# Altium project DSPBOARD.PRJPCB
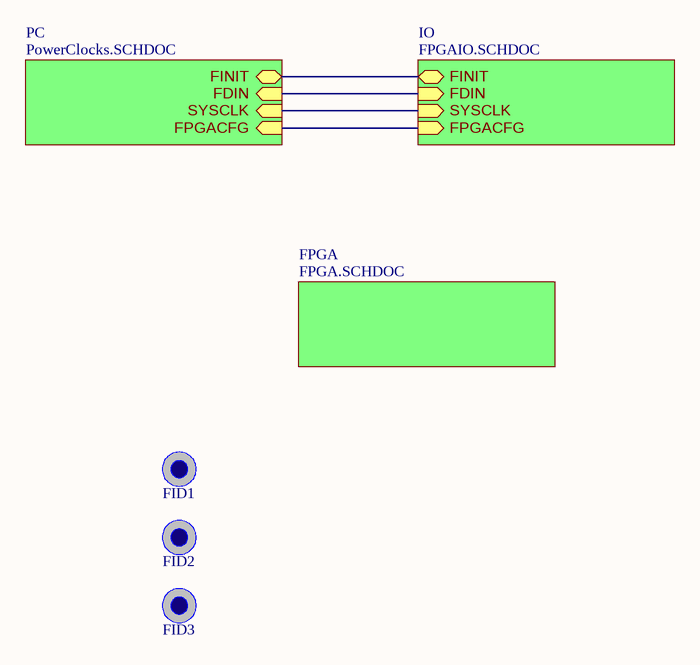
[diagram p0: main.SCHDOC]
6 sheets, 201 parts. Net scope: hierarchical (ports join the sheet entries above them; power ports are global).
Board file: pcb.PCBDOC
Sheets:
  main.SCHDOC
    PC = PowerClocks.SCHDOC
    IO = FPGAIO.SCHDOC
      FIBER = fiber.SCHDOC
    FPGA = FPGA.SCHDOC
      A = DSP.SCHDOC
      B = DSP.SCHDOC
      C = DSP.SCHDOC
      D = DSP.SCHDOC

## Sheet main.SCHDOC
size B

### Parts
FID1  *  [FIDUCIAL]  (value not drawn)
FID2  *  [FIDUCIAL]  (value not drawn)
FID3  *  [FIDUCIAL]  (value not drawn)

### Sub-sheets
FPGA = FPGA.SCHDOC: no entries
IO = FPGAIO.SCHDOC: FPGACFG (in), SYSCLK (in), FINIT (bidir), FDIN (in)
PC = PowerClocks.SCHDOC: FINIT (bidir), FDIN (in), SYSCLK (in), FPGACFG (in)

### Nets
NetIO1_P13: sheet PC/FPGACFG, sheet IO/FPGACFG
NetO1_3: sheet PC/SYSCLK, sheet IO/SYSCLK
NetU3_M11: sheet PC/FDIN, sheet IO/FDIN
NetU3_N9: sheet PC/FINIT, sheet IO/FINIT

### Notes on the sheet
- Title:
- Engineer:
- Date:
- Revision:
- Sheet
- of
- File:

### Library data of the parts
FID1-FID3 = FIDUCIAL

## Sheet PowerClocks.SCHDOC
size B
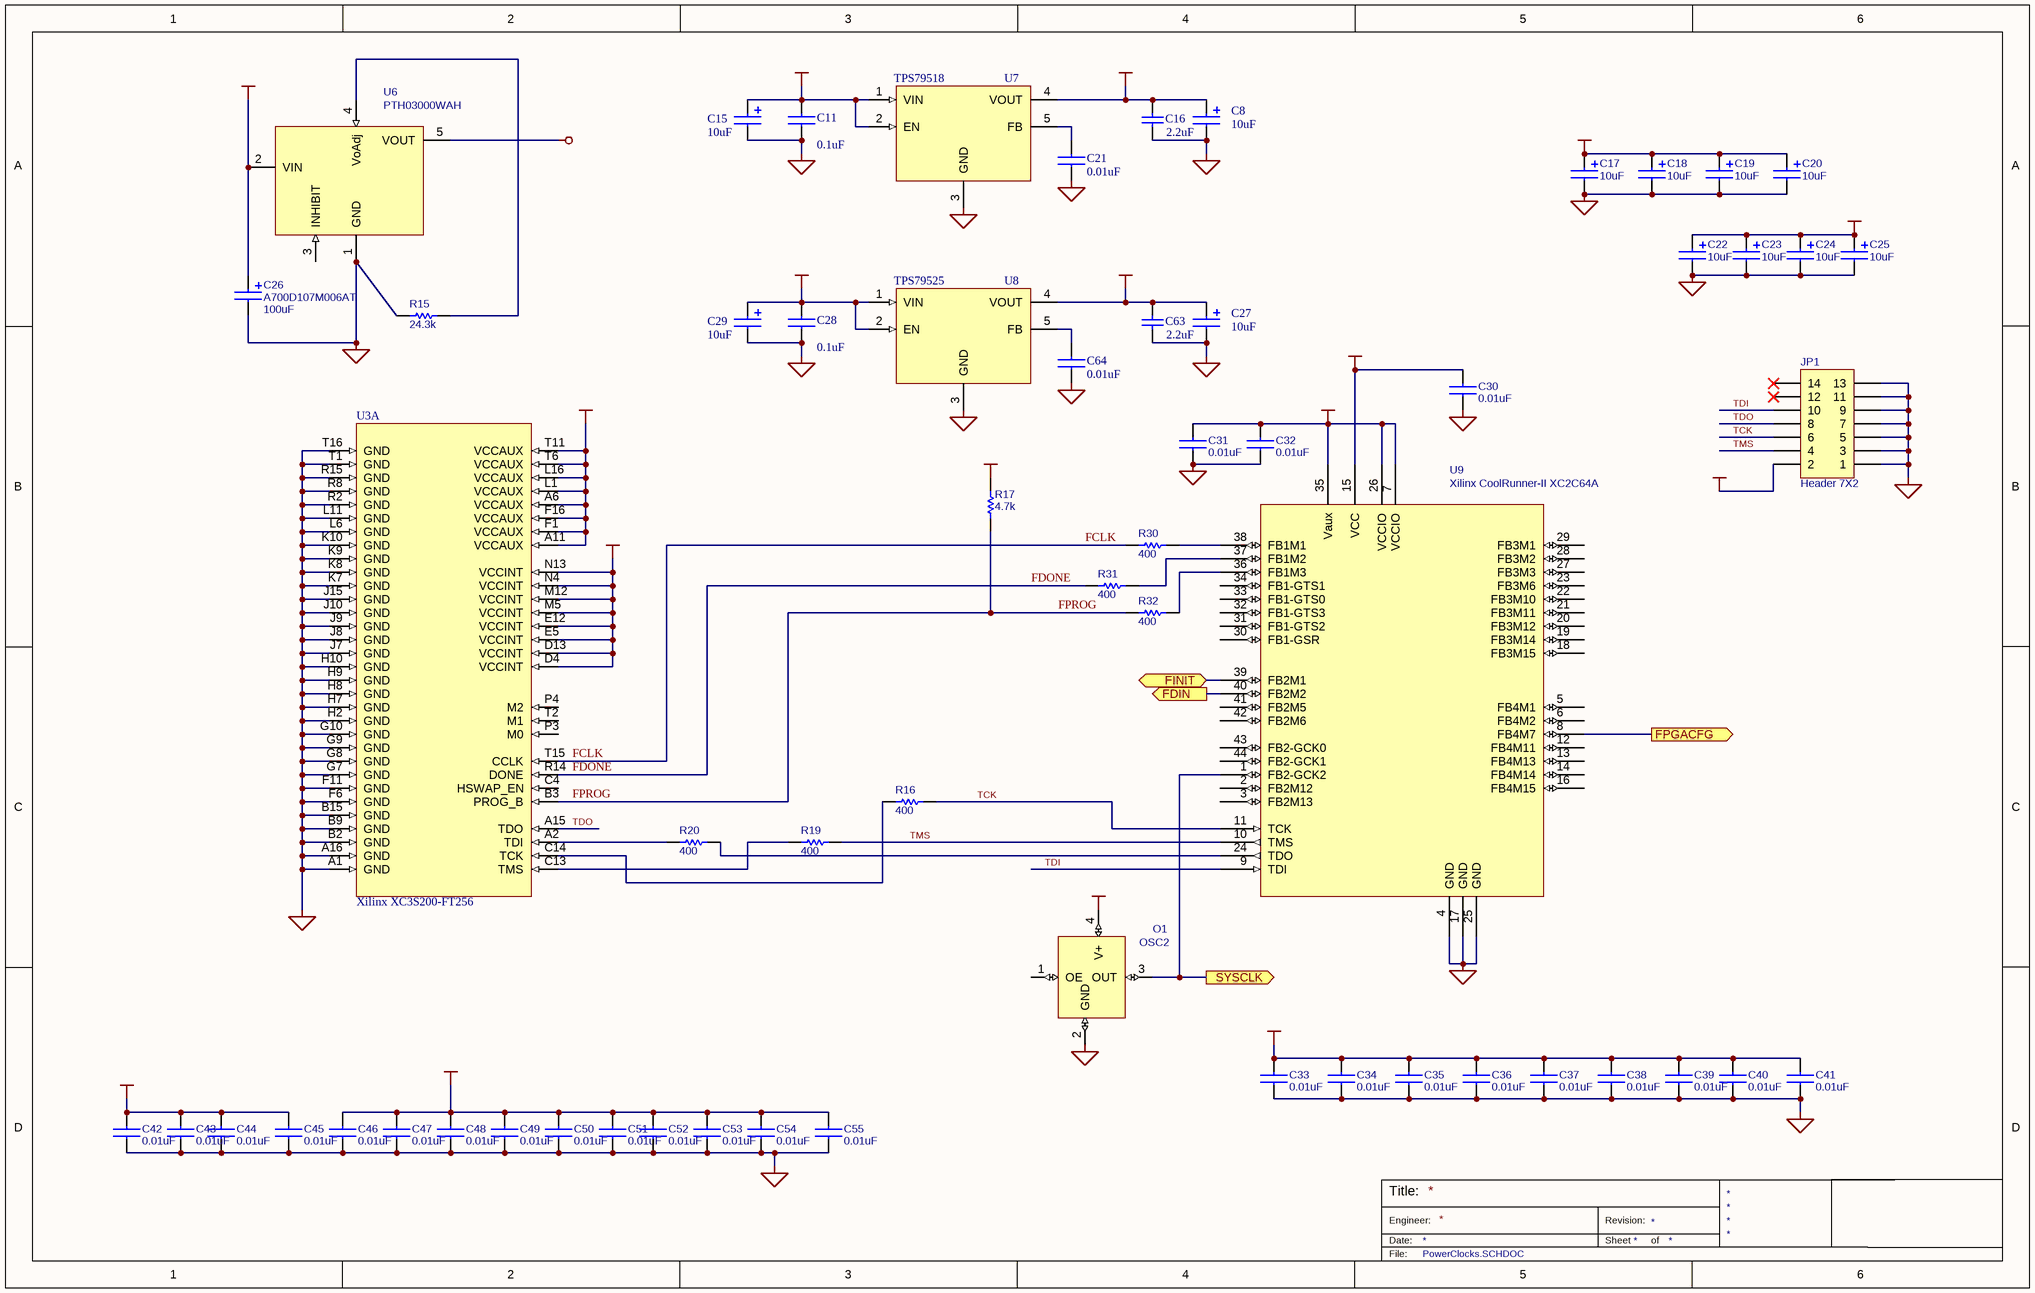
[diagram p1: PowerClocks.SCHDOC]

### Parts
C8  value 10uF  [3216]  (hidden comment: POLCAP)
C11  value 0.1uF  [0603]  (hidden comment: CAPACITOR)
C15  value 10uF  [3216]  (hidden comment: POLCAP)
C16  value 2.2uF  [1206]  (hidden comment: Cap)
C17  value 10uF  [3216]  (hidden comment: Bypass Cap)
C18  value 10uF  [3216]  (hidden comment: Bypass Cap)
C19  value 10uF  [3216]  (hidden comment: Bypass Cap)
C20  value 10uF  [3216]  (hidden comment: Bypass Cap)
C21  value 0.01uF  [0402]  (hidden comment: CAPACITOR)
C22  value 10uF  [3216]  (hidden comment: Bypass Cap)
C23  value 10uF  [3216]  (hidden comment: Bypass Cap)
C24  value 10uF  [3216]  (hidden comment: Bypass Cap)
C25  value 10uF  [3216]  (hidden comment: Bypass Cap)
C26  A700D107M006AT  value 100uF  [7343]
C27  value 10uF  [3216]  (hidden comment: POLCAP)
C28  value 0.1uF  [0603]  (hidden comment: CAPACITOR)
C29  value 10uF  [3216]  (hidden comment: POLCAP)
C30  value 0.01uF  [0402]  (hidden comment: CAPACITOR)
C31  value 0.01uF  [0402]  (hidden comment: CAPACITOR)
C32  value 0.01uF  [0402]  (hidden comment: CAPACITOR)
C33  value 0.01uF  [0402]  (hidden comment: CAPACITOR)
C34  value 0.01uF  [0402]  (hidden comment: CAPACITOR)
C35  value 0.01uF  [0402]  (hidden comment: CAPACITOR)
C36  value 0.01uF  [0402]  (hidden comment: CAPACITOR)
C37  value 0.01uF  [0402]  (hidden comment: CAPACITOR)
C38  value 0.01uF  [0402]  (hidden comment: CAPACITOR)
C39  value 0.01uF  [0402]  (hidden comment: CAPACITOR)
C40  value 0.01uF  [0402]  (hidden comment: CAPACITOR)
C41  value 0.01uF  [0402]  (hidden comment: CAPACITOR)
C42  value 0.01uF  [0402]  (hidden comment: CAPACITOR)
C43  value 0.01uF  [0402]  (hidden comment: CAPACITOR)
C44  value 0.01uF  [0402]  (hidden comment: CAPACITOR)
C45  value 0.01uF  [0402]  (hidden comment: CAPACITOR)
C46  value 0.01uF  [0402]  (hidden comment: CAPACITOR)
C47  value 0.01uF  [0402]  (hidden comment: CAPACITOR)
C48  value 0.01uF  [0402]  (hidden comment: CAPACITOR)
C49  value 0.01uF  [0402]  (hidden comment: CAPACITOR)
C50  value 0.01uF  [0402]  (hidden comment: CAPACITOR)
C51  value 0.01uF  [0402]  (hidden comment: CAPACITOR)
C52  value 0.01uF  [0402]  (hidden comment: CAPACITOR)
C53  value 0.01uF  [0402]  (hidden comment: CAPACITOR)
C54  value 0.01uF  [0402]  (hidden comment: CAPACITOR)
C55  value 0.01uF  [0402]  (hidden comment: CAPACITOR)
C63  value 2.2uF  [1206]  (hidden comment: Cap)
C64  value 0.01uF  [0402]  (hidden comment: CAPACITOR)
JP1  Header 7X2  [SMT 2x7 2mm HDR]
O1  OSC2  [ECS-3953M]
R15  value 24.3k  [1206]  (hidden comment: RESISTOR)
R16  value 400  [0603]  (hidden comment: current-limiting series res)
R17  value 4.7k  [0603]  (hidden comment: RESISTOR)
R19  value 400  [0603]  (hidden comment: current-limiting series res)
R20  value 400  [0603]  (hidden comment: current-limiting series res)
R30  value 400  [0603]  (hidden comment: current-limiting series res)
R31  value 400  [0603]  (hidden comment: current-limiting series res)
R32  value 400  [0603]  (hidden comment: current-limiting series res)
U3  Xilinx XC3S200-FT256  [Xilinx FT256 BGA]  (part A of 9)
U6  PTH03000WAH  [TI EUS]
U7  TPS79518  [SOT223-5/Simple]
U8  TPS79525  [SOT223-5/Simple]
U9  Xilinx CoolRunner-II XC2C64A  [QFP10x10-G44/G10N]

### Ports
FDIN (out), FINIT (bidir), FPGACFG (out), SYSCLK (out)

### Nets
+1.2VCC: C22.1 C23.1 C24.1 C25.1 C42.2 C43.2 C44.2 C45.2 U3.D4(VCCINT) U3.D13(VCCINT) U3.E5(VCCINT) U3.E12(VCCINT) U3.M5(VCCINT) U3.M12(VCCINT) U3.N4(VCCINT) U3.N13(VCCINT) U6.5(VOUT)
+1.8VCC: C8.1 C16.2 C30.2 U7.4(VOUT) U9.15(VCC)
+2.5VCC: C27.1 C46.2 C47.2 C48.2 C49.2 C50.2 C51.2 C52.2 C53.2 C54.2 C55.2 C63.2 R17.1 U3.A6(VCCAUX) U3.A11(VCCAUX) U3.F1(VCCAUX) U3.F16(VCCAUX) U3.L1(VCCAUX) U3.L16(VCCAUX) U3.T6(VCCAUX) U3.T11(VCCAUX) U8.4(VOUT)
GND: C8.2 C11.1 C15.2 C16.1 C17.2 C18.2 C19.2 C20.2 C21.1 C22.2 C23.2 C24.2 C25.2 C26.2 C27.2 C28.1 C29.2 C30.1 C31.1 C32.1 C33.1 C34.1 C35.1 C36.1 C37.1 C38.1 C39.1 C40.1 C41.1 C42.1 C43.1 C44.1 C45.1 C46.1 C47.1 C48.1 C49.1 C50.1 C51.1 C52.1 C53.1 C54.1 C55.1 C63.1 C64.1 JP1.1 JP1.3 JP1.5 JP1.7 JP1.9 JP1.11 JP1.13 O1.2(GND) R15.2 U3.A1(GND) U3.A16(GND) U3.B2(GND) U3.B9(GND) U3.B15(GND) U3.F6(GND) U3.F11(GND) U3.G7(GND) U3.G8(GND) U3.G9(GND) U3.G10(GND) U3.H2(GND) U3.H7(GND) U3.H8(GND) U3.H9(GND) U3.H10(GND) U3.J7(GND) U3.J8(GND) U3.J9(GND) U3.J10(GND) U3.J15(GND) U3.K7(GND) U3.K8(GND) U3.K9(GND) U3.K10(GND) U3.L6(GND) U3.L11(GND) U3.R2(GND) U3.R8(GND) U3.R15(GND) U3.T1(GND) U3.T16(GND) U6.1(GND) U7.3(GND) U8.3(GND) U9.4(GND) U9.17(GND) U9.25(GND)
VCC: C11.2 C15.1 C17.1 C18.1 C19.1 C20.1 C26.1 C28.2 C29.1 C31.2 C32.2 C33.2 C34.2 C35.2 C36.2 C37.2 C38.2 C39.2 C40.2 C41.2 JP1.2 O1.4(V+) U6.2(VIN) U7.1(VIN) U7.2(EN) U8.1(VIN) U8.2(EN) U9.7(VCCIO) U9.26(VCCIO) U9.35(Vaux)
FCLK: R30.2 U3.T15(CCLK)
FDONE: R31.2 U3.R14(DONE)
FPROG: R17.2 R32.2 U3.B3(PROG_B)
TCK: JP1.6 R16.1 U9.11(TCK)
TDI: JP1.10 U9.9(TDI)
TDO: JP1.8 U3.A15(TDO)
TMS: JP1.4 R19.2 U9.10(TMS)
NetC21_2: C21.2 U7.5(FB)
NetC64_2: C64.2 U8.5(FB)
NetIO1_P13: U9.8(FB4M7) ; port FPGACFG
NetO1_3: O1.3(OUT) U9.1(FB2-GCK2) ; port SYSCLK
NetR15_1: R15.1 U6.4(VoAdj)
NetR16_2: R16.2 U3.C14(TCK)
NetR19_1: R19.1 U3.C13(TMS)
NetR20_1: R20.1 U9.24(TDO)
NetR20_2: R20.2 U3.A2(TDI)
NetR30_1: R30.1 U9.38(FB1M1)
NetR31_1: R31.1 U9.37(FB1M2)
NetR32_1: R32.1 U9.36(FB1M3)
NetU3_M11: U9.40(FB2M2) ; port FDIN
NetU3_N9: U9.39(FB2M1) ; port FINIT

Not connected (* = marked no-connect by the designer): JP1 12* 14*; O1 1(OE); U3 C4(HSWAP_EN) P3(M0) P4(M2) T2(M1); U6 3(INHIBIT); U9 2(FB2M12) 3(FB2M13) 5(FB4M1) 6(FB4M2) 12(FB4M11) 13(FB4M13) 14(FB4M14) 16(FB4M15) 18(FB3M15) 19(FB3M14) 20(FB3M12) 21(FB3M11) 22(FB3M10) 23(FB3M6) 27(FB3M3) 28(FB3M2) 29(FB3M1) 30(FB1-GSR) 31(FB1-GTS2) 32(FB1-GTS3) 33(FB1-GTS0) 34(FB1-GTS1) 41(FB2M5) 42(FB2M6) 43(FB2-GCK0) 44(FB2-GCK1)

### Notes on the sheet
- Title:
- Engineer:
- Date:
- Revision:
- Sheet
- of
- File:

### Library data of the parts
C8 C15 C17-C20 C22-C25 C27 C29 = POLCAP: Standard Capacitor; Voltage: 10V
C11 C21 C28 C30-C55 C64 = CAPACITOR: Standard Capacitor
C16 C63 = Cap: Capacitor; Manufacturer: Generic Components; Class I: Passive; Published: 8-Jun-2000; Revision: July-2002: Re-released for DXP Platform.; Publisher: Altium Limited; Class II: Capacitor
C26 = POLCAP: Standard Capacitor
JP1 = Header 7X2: Header, 7-Pin, Dual row; Manufacturer: Generic Components; Class I: Connector; Vendor: MOLEX 87831-1420; Revision: July-2002: Re-released for DXP Platform.; Publisher: Altium Limited
O1 = OSC2: ECS SMD Oscillator, ECS-3953M
R15 R16 R19 R20 R30-R32 = RESISTOR: Standard Passive Resistor
R17 = RESISTOR: Standard Passive Resistor; Tolerance: 1%
U3 = XC3S200-FT256: Xilinx Spartan-3 FPGA
U6 = PTH03000: TI POL converter, through-hole
U7 U8 = TPS795XX: TI Ultra-low-noise LDO
U9 = XC2C64A-5VQ44C

## Sheet FPGAIO.SCHDOC
size B
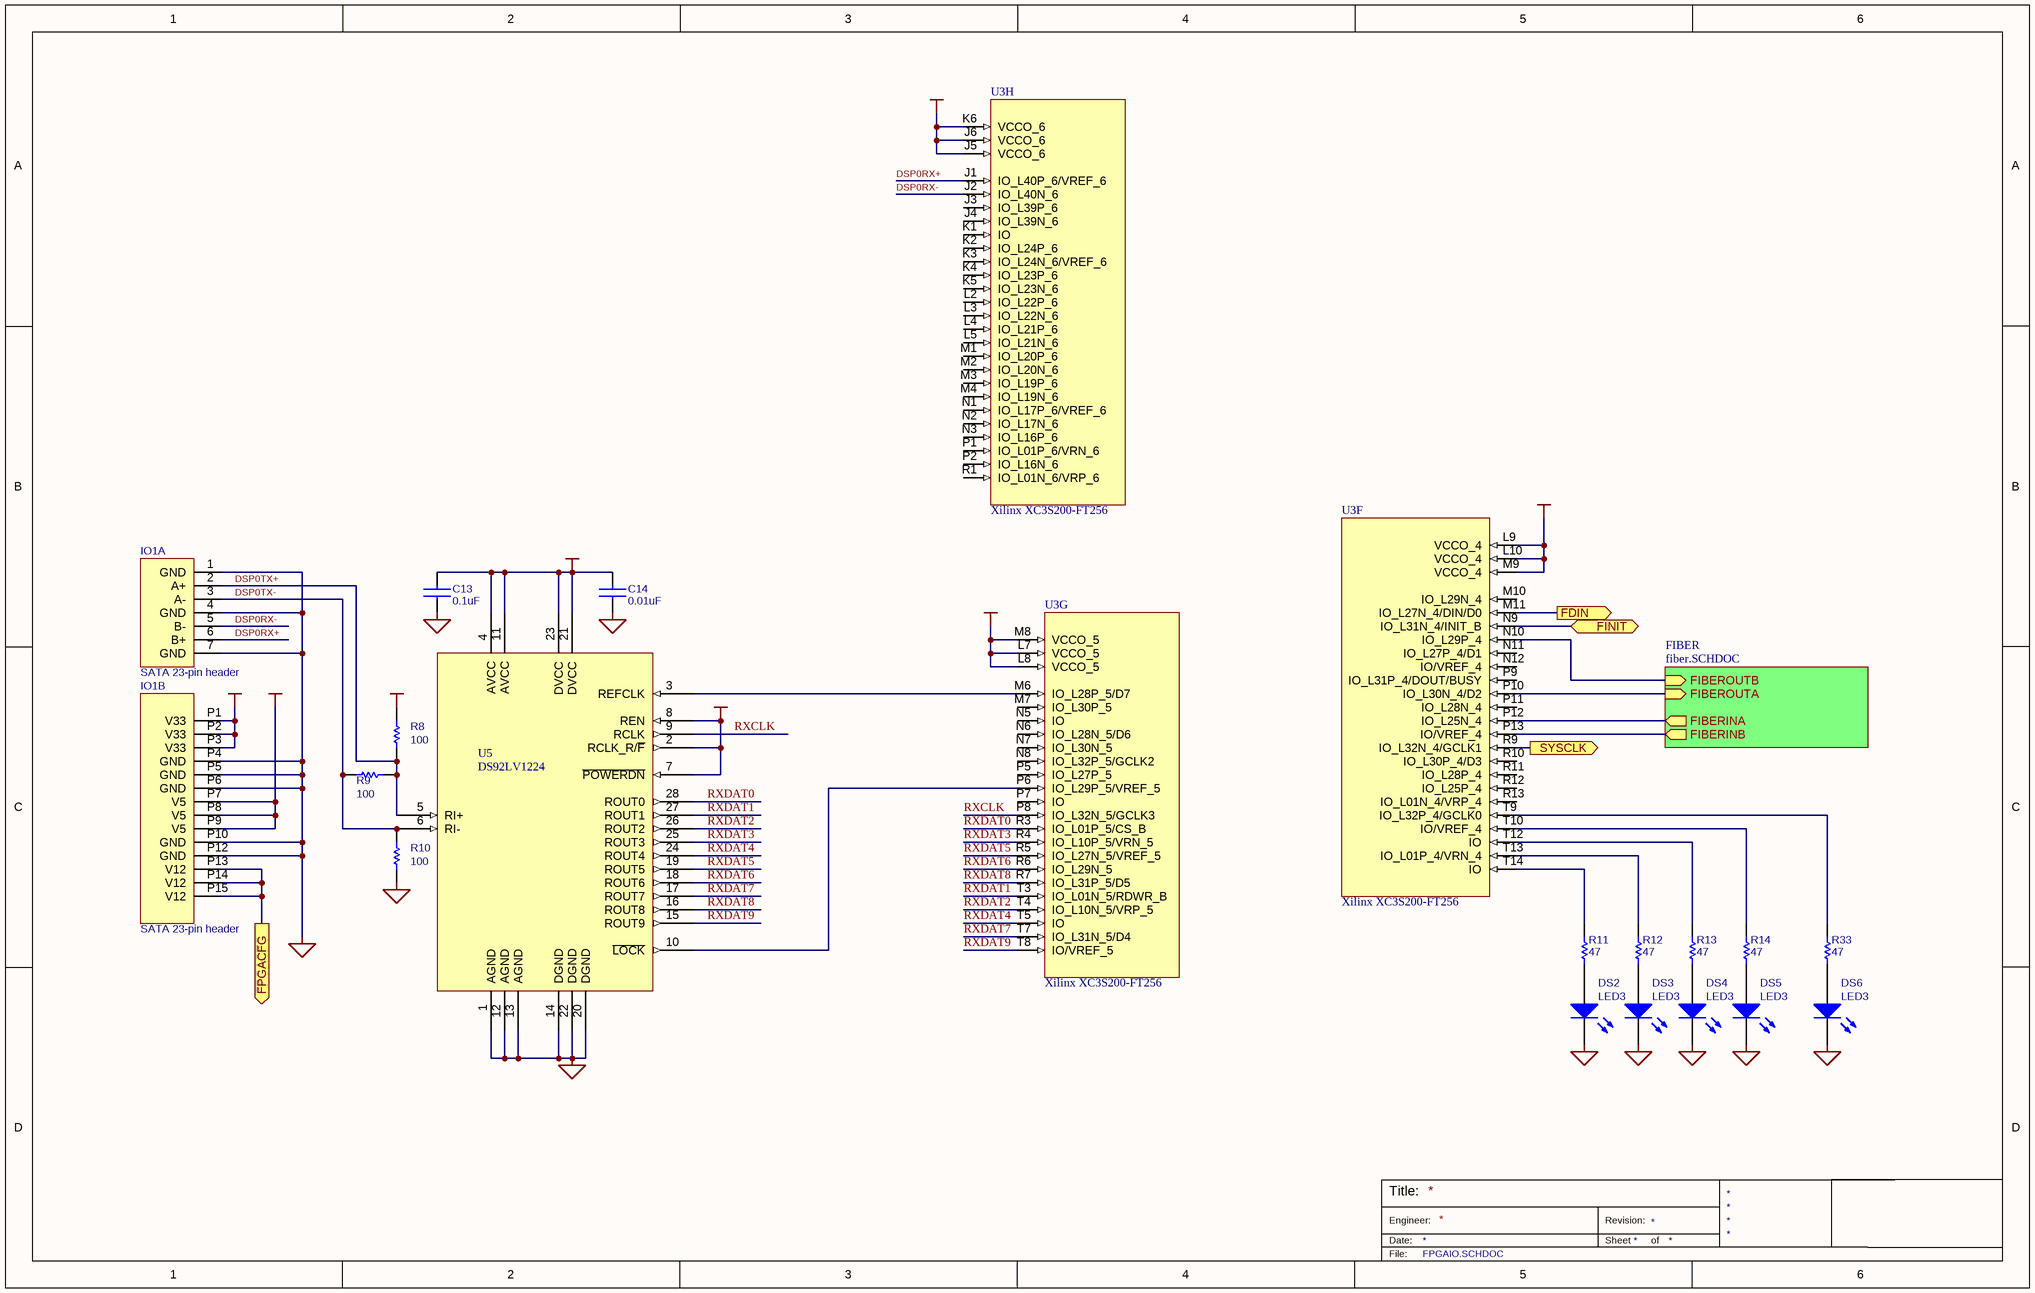
[diagram p2: FPGAIO.SCHDOC]

### Parts
C13  value 0.1uF  [0603]  (hidden comment: CAPACITOR)
C14  value 0.01uF  [0402]  (hidden comment: CAPACITOR)
DS2  LED3  [LED0805]
DS3  LED3  [LED0805]
DS4  LED3  [LED0805]
DS5  LED3  [LED0805]
DS6  LED3  [LED0805]
IO1  SATA 23-pin header  [MOLEX 87703-0001]  (parts A,B of 2)
R8  100  [0603]
R9  100  [0603]
R10  100  [0603]
R11  value 47  [0603]  (hidden comment: RESISTOR)
R12  value 47  [0603]  (hidden comment: RESISTOR)
R13  value 47  [0603]  (hidden comment: RESISTOR)
R14  value 47  [0603]  (hidden comment: RESISTOR)
R33  value 47  [0603]  (hidden comment: RESISTOR)
U3  Xilinx XC3S200-FT256  [Xilinx FT256 BGA]  (parts F,G,H of 9)
U5  DS92LV1224  [SSO-G28/E4.3]

### Sub-sheets
FIBER = fiber.SCHDOC: FIBERINA (out), FIBEROUTB (in), FIBERINB (out), FIBEROUTA (in)

### Ports
FDIN (out), FINIT (bidir), FPGACFG (out), SYSCLK (out)

### Nets
+2.5VCC: U3.J5(VCCO_6) U3.J6(VCCO_6) U3.K6(VCCO_6)
+5VCC: IO1.P7(V5) IO1.P8(V5) IO1.P9(V5)
GND: C13.1 C14.1 DS2.2(K) DS3.2(K) DS4.2(K) DS5.2(K) DS6.2(K) IO1.1(GND) IO1.4(GND) IO1.7(GND) IO1.P4(GND) IO1.P5(GND) IO1.P6(GND) IO1.P10(GND) IO1.P12(GND) R10.1 U5.1(AGND) U5.12(AGND) U5.13(AGND) U5.14(DGND) U5.20(DGND) U5.22(DGND)
VCC: C13.2 C14.2 IO1.P1(V33) IO1.P2(V33) IO1.P3(V33) R8.1 U3.L7(VCCO_5) U3.L8(VCCO_5) U3.L9(VCCO_4) U3.L10(VCCO_4) U3.M8(VCCO_5) U3.M9(VCCO_4) U5.2(RCLK_R/~{F}) U5.4(AVCC) U5.7(~{POWERDN}) U5.8(REN) U5.11(AVCC) U5.21(DVCC) U5.23(DVCC)
DSP0RX+: IO1.6(B+) U3.J1(IO_L40P_6/VREF_6)
DSP0RX-: IO1.5(B-) U3.J2(IO_L40N_6)
DSP0TX+: IO1.2(A+) R8.2 R9.2 U5.5(RI+)
DSP0TX-: IO1.3(A-) R9.1 R10.2 U5.6(RI-)
RXCLK: U3.P8(IO_L32N_5/GCLK3) U5.9(RCLK)
RXDAT0: U3.R3(IO_L01P_5/CS_B) U5.28(ROUT0)
RXDAT1: U3.T3(IO_L01N_5/RDWR_B) U5.27(ROUT1)
RXDAT2: U3.T4(IO_L10N_5/VRP_5) U5.26(ROUT2)
RXDAT3: U3.R4(IO_L10P_5/VRN_5) U5.25(ROUT3)
RXDAT4: U3.T5(IO) U5.24(ROUT4)
RXDAT5: U3.R5(IO_L27N_5/VREF_5) U5.19(ROUT5)
RXDAT6: U3.R6(IO_L29N_5) U5.18(ROUT6)
RXDAT7: U3.T7(IO_L31N_5/D4) U5.17(ROUT7)
RXDAT8: U3.R7(IO_L31P_5/D5) U5.16(ROUT8)
RXDAT9: U3.T8(IO/VREF_5) U5.15(ROUT9)
NetDS2_1: DS2.1(A) R11.2
NetDS3_1: DS3.1(A) R12.2
NetDS4_1: DS4.1(A) R13.2
NetDS5_1: DS5.1(A) R14.2
NetDS6_1: DS6.1(A) R33.2
NetIO1_P13: IO1.P13(V12) IO1.P14(V12) IO1.P15(V12) ; port FPGACFG
NetO1_3: U3.R9(IO_L32N_4/GCLK1) ; port SYSCLK
NetR11_1: R11.1 U3.T14(IO)
NetR12_1: R12.1 U3.T13(IO_L01P_4/VRN_4)
NetR13_1: R13.1 U3.T12(IO)
NetR14_1: R14.1 U3.T10(IO/VREF_4)
NetR24_1: U3.P10(IO_L30N_4/D2) ; sheet FIBER/FIBEROUTA
NetR28_1: U3.N10(IO_L29P_4) ; sheet FIBER/FIBEROUTB
NetR33_1: R33.1 U3.T9(IO_L32P_4/GCLK0)
NetU3_M6: U3.M6(IO_L28P_5/D7) U5.3(REFCLK)
NetU3_M11: U3.M11(IO_L27N_4/DIN/D0) ; port FDIN
NetU3_N9: U3.N9(IO_L31N_4/INIT_B) ; port FINIT
NetU3_P6: U3.P6(IO_L29P_5/VREF_5) U5.10(~{LOCK})
NetU3_P12: U3.P12(IO_L25N_4) ; sheet FIBER/FIBERINA
NetU3_P13: U3.P13(IO/VREF_4) ; sheet FIBER/FIBERINB

Not connected (* = marked no-connect by the designer): U3 J3(IO_L39P_6) J4(IO_L39N_6) K1(IO) K2(IO_L24P_6) K3(IO_L24N_6/VREF_6) K4(IO_L23P_6) K5(IO_L23N_6) L2(IO_L22P_6) L3(IO_L22N_6) L4(IO_L21P_6) L5(IO_L21N_6) M1(IO_L20P_6) M2(IO_L20N_6) M3(IO_L19P_6) M4(IO_L19N_6) M7(IO_L30P_5) M10(IO_L29N_4) N1(IO_L17P_6/VREF_6) N2(IO_L17N_6) N3(IO_L16P_6) N5(IO) N6(IO_L28N_5/D6) N7(IO_L30N_5) N8(IO_L32P_5/GCLK2) N11(IO_L27P_4/D1) N12(IO/VREF_4) P1(IO_L01P_6/VRN_6) P2(IO_L16N_6) P5(IO_L27P_5) P7(IO) P9(IO_L31P_4/DOUT/BUSY) P11(IO_L28N_4) R1(IO_L01N_6/VRP_6) R10(IO_L30P_4/D3) R11(IO_L28P_4) R12(IO_L25P_4) R13(IO_L01N_4/VRP_4)

### Notes on the sheet
- Title:
- Engineer:
- Date:
- Revision:
- Sheet
- of
- File:

### Library data of the parts
C13 C14 = CAPACITOR: Standard Capacitor
DS2-DS6 = LED3: Typical BLUE SiC LED; Published: 8-Jun-2000; LatestRevisionDate: 17-Dec-2003; LatestRevisionNote: PCB Footprint replaced.; Publisher: Altium Limited
IO1 = SATA-23: Molex 1.27mm pitch SATA device Plug
R8-R10 = RESISTOR: Standard Passive Resistor; Value: 100
R11-R14 R33 = RESISTOR: Standard Passive Resistor; Tolerance: 1%
U3 = XC3S200-FT256: Xilinx Spartan-3 FPGA
U5 = DS92LV1224: 30-66 MHz 10-Bit Bus LVDS Deserializer

## Sheet fiber.SCHDOC
size B
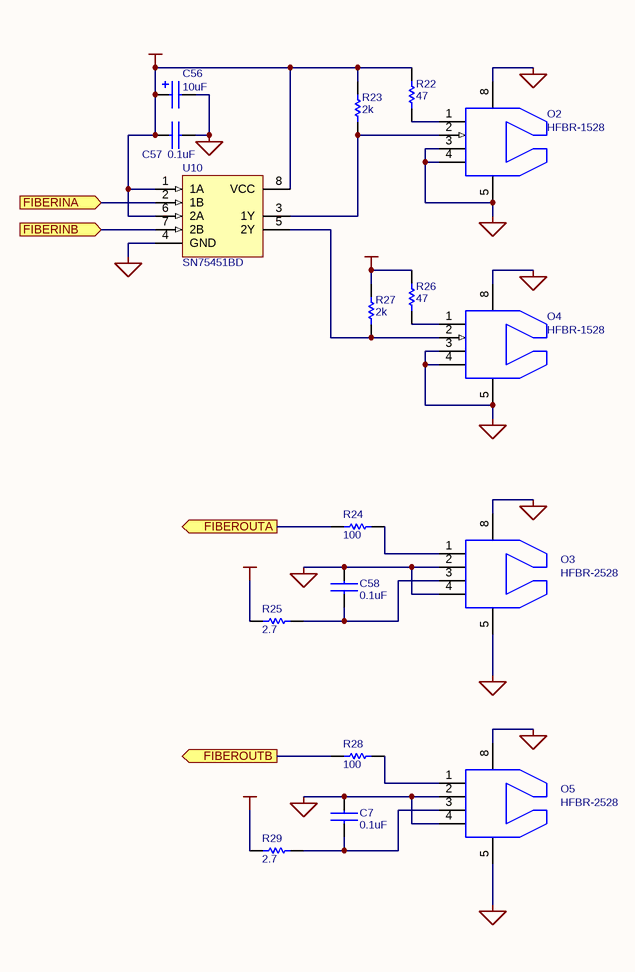
[diagram p3: fiber.SCHDOC]

### Parts
C7  value 0.1uF  [0603]  (hidden comment: CAPACITOR)
C56  value 10uF  [3216]  (hidden comment: Bypass Cap)
C57  value 0.1uF  [0603]  (hidden comment: CAPACITOR)
C58  value 0.1uF  [0603]  (hidden comment: CAPACITOR)
O2  HFBR-1528  [HPVL]
O3  HFBR-2528  [HPVL]
O4  HFBR-1528  [HPVL]
O5  HFBR-2528  [HPVL]
R22  value 47  [0603]  (hidden comment: RESISTOR)
R23  value 2k  [0603]  (hidden comment: RESISTOR)
R24  value 100  [0603]  (hidden comment: RESISTOR)
R25  value 2.7  [0603]  (hidden comment: RESISTOR)
R26  value 47  [0603]  (hidden comment: RESISTOR)
R27  value 2k  [0603]  (hidden comment: RESISTOR)
R28  value 100  [0603]  (hidden comment: RESISTOR)
R29  value 2.7  [0603]  (hidden comment: RESISTOR)
U10  SN75451BD  [SO-G8/E2.5]

### Ports
FIBERINA (in), FIBERINB (in), FIBEROUTA (out), FIBEROUTB (out)

### Nets
+5VCC: C56.1 C57.1 R22.2 R23.2 R25.1 R26.2 R27.2 R29.1 U10.1(1A) U10.6(2A) U10.8(VCC)
GND: C7.2 C56.2 C57.2 C58.2 O2.3 O2.4 O2.5 O2.8 O3.2 O3.4 O3.5 O3.8 O4.3 O4.4 O4.5 O4.8 O5.2 O5.4 O5.5 O5.8 U10.4(GND)
NetC7_1: C7.1 O5.3 R29.2
NetC58_1: C58.1 O3.3 R25.2
NetO2_1: O2.1 R22.1
NetO2_2: O2.2 R23.1 U10.3(1Y)
NetO3_1: O3.1 R24.2
NetO4_1: O4.1 R26.1
NetO4_2: O4.2 R27.1 U10.5(2Y)
NetO5_1: O5.1 R28.2
NetR24_1: R24.1 ; port FIBEROUTA
NetR28_1: R28.1 ; port FIBEROUTB
NetU3_P12: U10.2(1B) ; port FIBERINA
NetU3_P13: U10.7(2B) ; port FIBERINB

### Notes on the sheet
- Title:
- Engineer:
- Date:
- Revision:
- Sheet
- of
- File:

### Library data of the parts
C7 C57 C58 = CAPACITOR: Standard Capacitor
C56 = POLCAP: Standard Capacitor
O2 O4 = HFBR-1528: Low-cost fiber transmitter
O3 O5 = HFBR-2528: Low-cost fiber receiver
R22-R29 = RESISTOR: Standard Passive Resistor
U10 = SN75451BD: Dual Peripheral Driver; Manufacturer: Texas Instruments; Package Information: Latest Revision: Jan-1998; Class I: Interface; Published: 15-May-2002; Datasheet: 1991 Interface Circuits Data Book (May-1990); Package Reference: D008; Publisher: Altium Limited; Class II: Peripheral Driver

## Sheet FPGA.SCHDOC
size B; PageSetup: Record=PageOptions|CenterHorizontal=True|CenterVertical=True|PrintScale=1.12|XCorrection=1.00|YCorrection=1.00|PrintKind=1|BorderSize=5000000|LeftOffset=0|BottomOffset=0|Orientation=2|PaperLength=1000|PaperWidth=1000|Scale=100|PaperSource=7|PrintQuality=600|MediaType=1|DitherType=10|PaperKind=Tabloid|PrintScaleMode=1
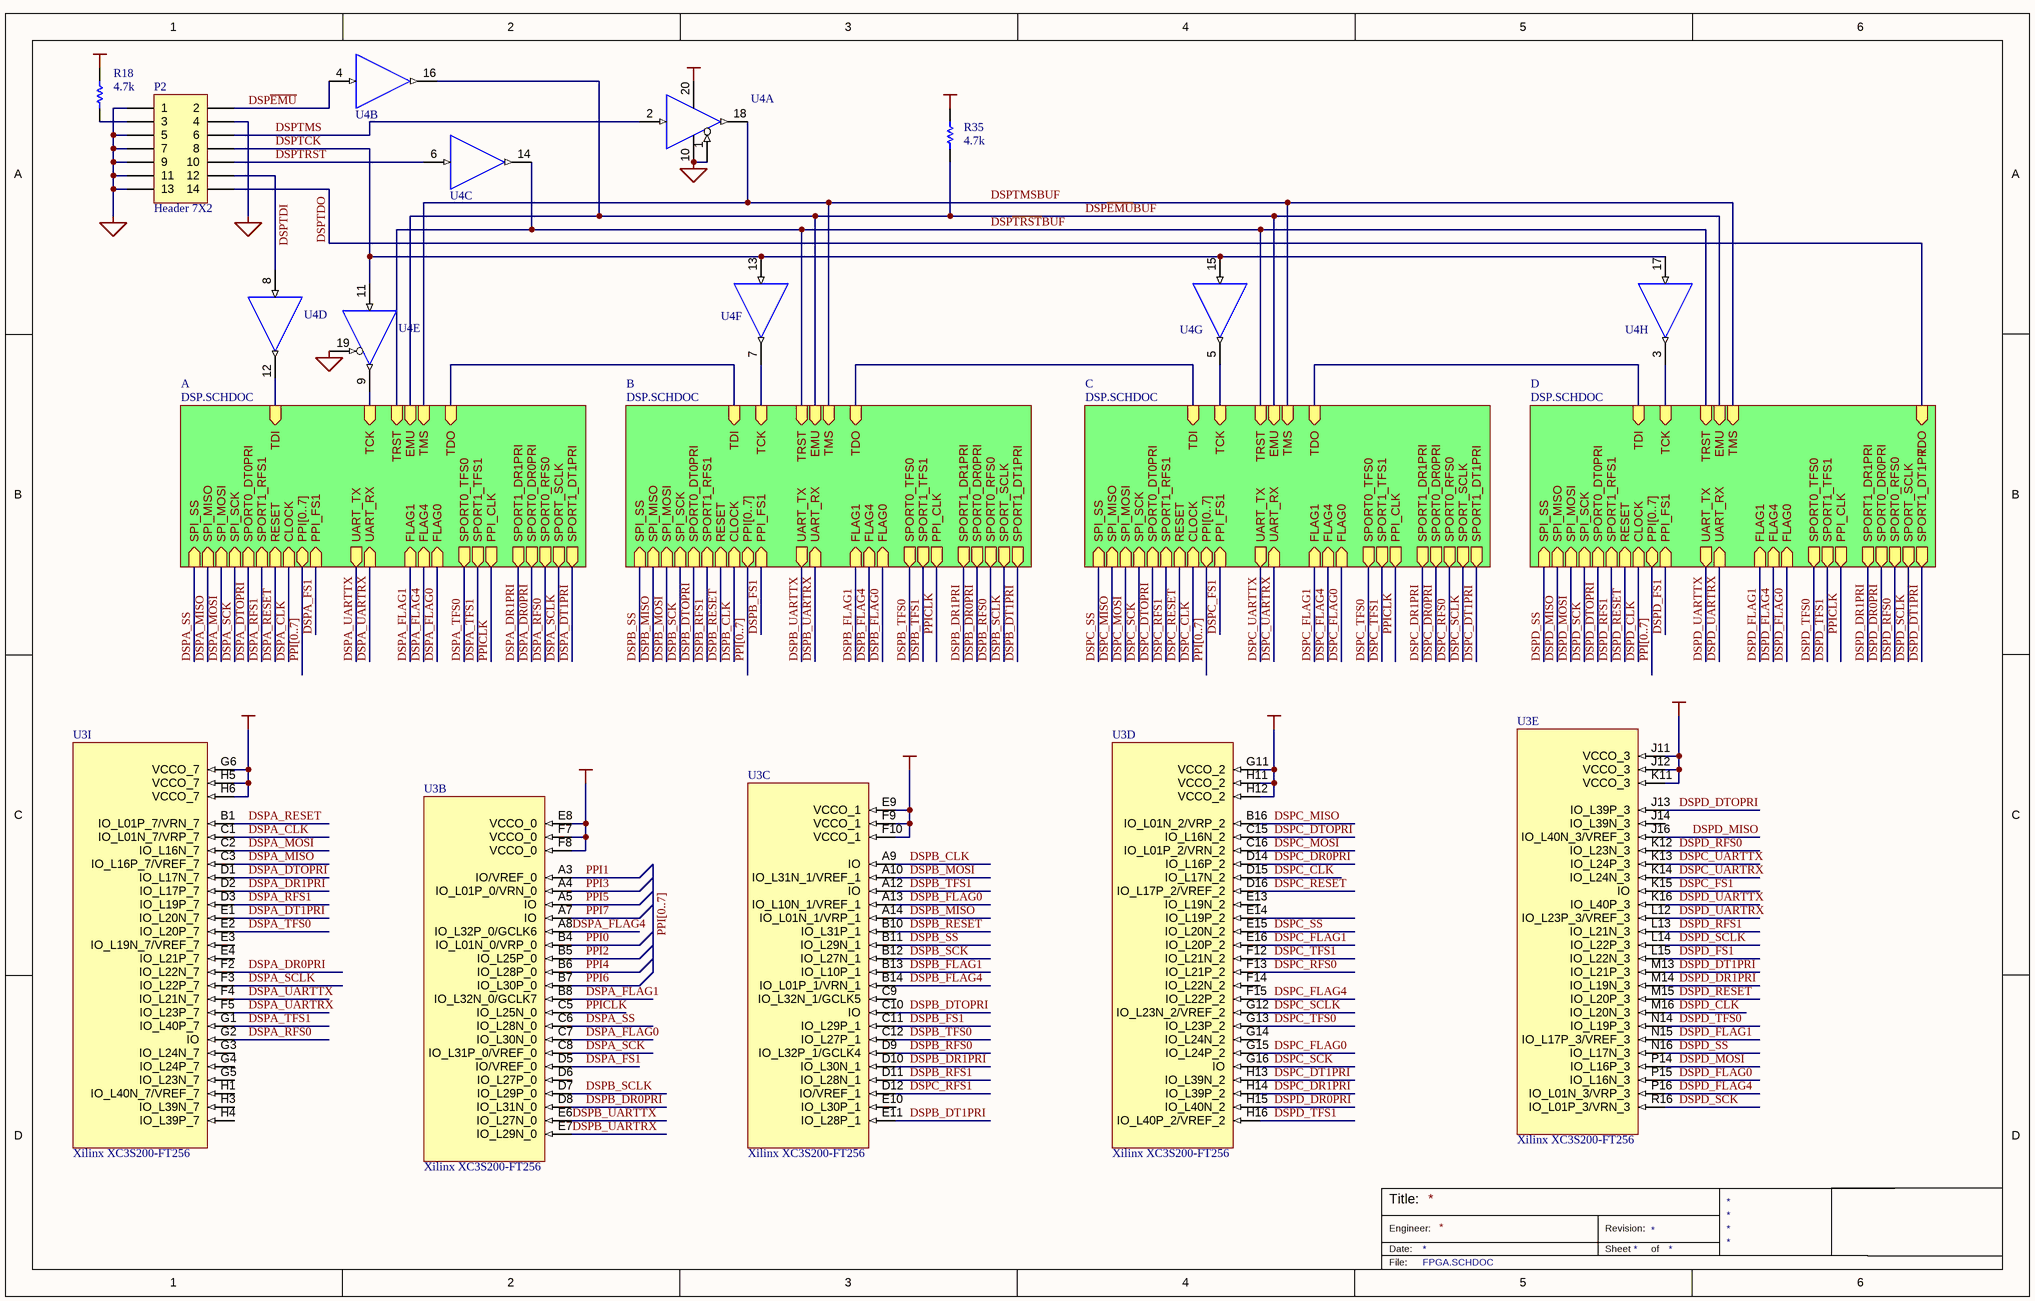
[diagram p4: FPGA.SCHDOC]

### Parts
P2  Header 7X2  [HDR2X7]
R18  value 4.7k  [0603]  (hidden comment: RESISTOR)
R35  value 4.7k  [0603]  (hidden comment: RESISTOR)
U3  Xilinx XC3S200-FT256  [Xilinx FT256 BGA]  (parts B,C,D,E,I of 9)
U4  SN54LVTH244A  [RGY]  (value not drawn)  (parts A,B,C,D,E,F,G,H of 8)

### Sub-sheets
A = DSP.SCHDOC: SPI_SS (in), SPI_MISO (in), SPI_MOSI (in), SPI_SCK (in), SPORT_SCLK (out), SPORT0_RFS0 (out), SPORT0_DR0PRI (out), SPORT1_DR1PRI (out), SPORT1_TFS1 (out), SPORT0_TFS0 (out), SPORT0_DT0PRI (in), SPORT1_RFS1 (in), RESET (in), CLOCK (in), PPI_CLK (out), PPI[0..7] (bidir), PPI_FS1 (in), TCK (in), TDI (in), TRST (in), EMU (in), TMS (in), TDO (in), FLAG1 (in), FLAG4 (in), FLAG0 (in), SPORT1_DT1PRI (out), UART_TX (out), UART_RX (in)
B = DSP.SCHDOC: SPI_SS (in), SPI_MISO (in), SPI_MOSI (in), SPI_SCK (in), SPORT_SCLK (out), SPORT0_RFS0 (out), SPORT0_DR0PRI (out), SPORT1_DR1PRI (out), SPORT1_TFS1 (out), SPORT0_TFS0 (out), SPORT0_DT0PRI (in), SPORT1_RFS1 (in), RESET (in), CLOCK (in), PPI_CLK (out), PPI[0..7] (bidir), PPI_FS1 (in), TCK (in), TDI (in), TRST (in), EMU (in), TMS (in), TDO (in), FLAG1 (in), FLAG4 (in), FLAG0 (in), SPORT1_DT1PRI (out), UART_TX (out), UART_RX (in)
C = DSP.SCHDOC: SPI_SS (in), SPI_MISO (in), SPI_MOSI (in), SPI_SCK (in), SPORT_SCLK (out), SPORT0_RFS0 (out), SPORT0_DR0PRI (out), SPORT1_DR1PRI (out), SPORT1_TFS1 (out), SPORT0_TFS0 (out), SPORT0_DT0PRI (in), SPORT1_RFS1 (in), RESET (in), CLOCK (in), PPI_CLK (out), PPI[0..7] (bidir), PPI_FS1 (in), TCK (in), TDI (in), TRST (in), EMU (in), TMS (in), TDO (in), FLAG1 (in), FLAG4 (in), FLAG0 (in), SPORT1_DT1PRI (out), UART_TX (out), UART_RX (in)
D = DSP.SCHDOC: SPI_SS (in), SPI_MISO (in), SPI_MOSI (in), SPI_SCK (in), SPORT_SCLK (out), SPORT0_RFS0 (out), SPORT0_DR0PRI (out), SPORT1_DR1PRI (out), SPORT1_TFS1 (out), SPORT0_TFS0 (out), SPORT0_DT0PRI (in), SPORT1_RFS1 (in), RESET (in), CLOCK (in), PPI_CLK (out), PPI[0..7] (bidir), PPI_FS1 (in), TCK (in), TDI (in), TRST (in), EMU (in), TMS (in), TDO (in), FLAG1 (in), FLAG4 (in), FLAG0 (in), SPORT1_DT1PRI (out), UART_TX (out), UART_RX (in)

### Nets
GND: P2.1 P2.4 P2.5 P2.7 P2.9 P2.11 P2.13 U4.1(~{1OE}) U4.10(GND) U4.19(~{2OE})
VCC: R18.2 R35.2 U3.E8(VCCO_0) U3.E9(VCCO_1) U3.F7(VCCO_0) U3.F8(VCCO_0) U3.F9(VCCO_1) U3.F10(VCCO_1) U3.G6(VCCO_7) U3.G11(VCCO_2) U3.H5(VCCO_7) U3.H6(VCCO_7) U3.H11(VCCO_2) U3.H12(VCCO_2) U3.J11(VCCO_3) U3.J12(VCCO_3) U3.K11(VCCO_3) U4.20(VCC)
DSPA_CLK: U3.C1(IO_L01N_7/VRP_7) ; sheet A/CLOCK
DSPA_DR0PRI: U3.F2(IO_L22N_7) ; sheet A/SPORT0_DR0PRI
DSPA_DR1PRI: U3.D2(IO_L17P_7) ; sheet A/SPORT1_DR1PRI
DSPA_DT1PRI: U3.E1(IO_L20N_7) ; sheet A/SPORT1_DT1PRI
DSPA_DTOPRI: U3.D1(IO_L17N_7) ; sheet A/SPORT0_DT0PRI
DSPA_FLAG0: U3.C7(IO_L30N_0) ; sheet A/FLAG0
DSPA_FLAG1: U3.B8(IO_L32N_0/GCLK7) ; sheet A/FLAG1
DSPA_FLAG4: U3.A8(IO_L32P_0/GCLK6) ; sheet A/FLAG4
DSPA_FS1: U3.D5(IO/VREF_0) ; sheet A/PPI_FS1
DSPA_MISO: U3.C3(IO_L16P_7/VREF_7) ; sheet A/SPI_MISO
DSPA_MOSI: U3.C2(IO_L16N_7) ; sheet A/SPI_MOSI
DSPA_RESET: U3.B1(IO_L01P_7/VRN_7) ; sheet A/RESET
DSPA_RFS0: U3.G2(IO) ; sheet A/SPORT0_RFS0
DSPA_RFS1: U3.D3(IO_L19P_7) ; sheet A/SPORT1_RFS1
DSPA_SCK: U3.C8(IO_L31P_0/VREF_0) ; sheet A/SPI_SCK
DSPA_SCLK: U3.F3(IO_L22P_7) ; sheet A/SPORT_SCLK
DSPA_SS: U3.C6(IO_L28N_0) ; sheet A/SPI_SS
DSPA_TFS0: U3.E2(IO_L20P_7) ; sheet A/SPORT0_TFS0
DSPA_TFS1: U3.G1(IO_L40P_7) ; sheet A/SPORT1_TFS1
DSPA_UARTRX: U3.F5(IO_L23P_7) ; sheet A/UART_RX
DSPA_UARTTX: U3.F4(IO_L21N_7) ; sheet A/UART_TX
DSPB_CLK: U3.A9(IO) ; sheet B/CLOCK
DSPB_DR0PRI: U3.D8(IO_L31N_0) ; sheet B/SPORT0_DR0PRI
DSPB_DR1PRI: U3.D10(IO_L30N_1) ; sheet B/SPORT1_DR1PRI
DSPB_DT1PRI: U3.E11(IO_L28P_1) ; sheet B/SPORT1_DT1PRI
DSPB_DTOPRI: U3.C10(IO) ; sheet B/SPORT0_DT0PRI
DSPB_FLAG0: U3.A13(IO_L10N_1/VREF_1) ; sheet B/FLAG0
DSPB_FLAG1: U3.B13(IO_L10P_1) ; sheet B/FLAG1
DSPB_FLAG4: U3.B14(IO_L01P_1/VRN_1) ; sheet B/FLAG4
DSPB_FS1: U3.C11(IO_L29P_1) ; sheet B/PPI_FS1
DSPB_MISO: U3.A14(IO_L01N_1/VRP_1) ; sheet B/SPI_MISO
DSPB_MOSI: U3.A10(IO_L31N_1/VREF_1) ; sheet B/SPI_MOSI
DSPB_RESET: U3.B10(IO_L31P_1) ; sheet B/RESET
DSPB_RFS0: U3.D9(IO_L32P_1/GCLK4) ; sheet B/SPORT0_RFS0
DSPB_RFS1: U3.D11(IO_L28N_1) ; sheet B/SPORT1_RFS1
DSPB_SCK: U3.B12(IO_L27N_1) ; sheet B/SPI_SCK
DSPB_SCLK: U3.D7(IO_L29P_0) ; sheet B/SPORT_SCLK
DSPB_SS: U3.B11(IO_L29N_1) ; sheet B/SPI_SS
DSPB_TFS0: U3.C12(IO_L27P_1) ; sheet B/SPORT0_TFS0
DSPB_TFS1: U3.A12(IO) ; sheet B/SPORT1_TFS1
DSPB_UARTRX: U3.E7(IO_L29N_0) ; sheet B/UART_RX
DSPB_UARTTX: U3.E6(IO_L27N_0) ; sheet B/UART_TX
DSPC_CLK: U3.D15(IO_L17N_2) ; sheet C/CLOCK
DSPC_DR0PRI: U3.D14(IO_L16P_2) ; sheet C/SPORT0_DR0PRI
DSPC_DR1PRI: U3.H14(IO_L39P_2) ; sheet C/SPORT1_DR1PRI
DSPC_DT1PRI: U3.H13(IO_L39N_2) ; sheet C/SPORT1_DT1PRI
DSPC_DTOPRI: U3.C15(IO_L16N_2) ; sheet C/SPORT0_DT0PRI
DSPC_FLAG0: U3.G15(IO_L24P_2) ; sheet C/FLAG0
DSPC_FLAG1: U3.E16(IO_L20P_2) ; sheet C/FLAG1
DSPC_FLAG4: U3.F15(IO_L22P_2) ; sheet C/FLAG4
DSPC_FS1: U3.K15(IO) ; sheet C/PPI_FS1
DSPC_MISO: U3.B16(IO_L01N_2/VRP_2) ; sheet C/SPI_MISO
DSPC_MOSI: U3.C16(IO_L01P_2/VRN_2) ; sheet C/SPI_MOSI
DSPC_RESET: U3.D16(IO_L17P_2/VREF_2) ; sheet C/RESET
DSPC_RFS0: U3.F13(IO_L21P_2) ; sheet C/SPORT0_RFS0
DSPC_RFS1: U3.D12(IO/VREF_1) ; sheet C/SPORT1_RFS1
DSPC_SCK: U3.G16(IO) ; sheet C/SPI_SCK
DSPC_SCLK: U3.G12(IO_L23N_2/VREF_2) ; sheet C/SPORT_SCLK
DSPC_SS: U3.E15(IO_L20N_2) ; sheet C/SPI_SS
DSPC_TFS0: U3.G13(IO_L23P_2) ; sheet C/SPORT0_TFS0
DSPC_TFS1: U3.F12(IO_L21N_2) ; sheet C/SPORT1_TFS1
DSPC_UARTRX: U3.K14(IO_L24N_3) ; sheet C/UART_RX
DSPC_UARTTX: U3.K13(IO_L24P_3) ; sheet C/UART_TX
DSPD_CLK: U3.M16(IO_L20N_3) ; sheet D/CLOCK
DSPD_DR0PRI: U3.H15(IO_L40N_2) ; sheet D/SPORT0_DR0PRI
DSPD_DR1PRI: U3.M14(IO_L19N_3) ; sheet D/SPORT1_DR1PRI
DSPD_DT1PRI: U3.M13(IO_L21P_3) ; sheet D/SPORT1_DT1PRI
DSPD_DTOPRI: U3.J13(IO_L39P_3) ; sheet D/SPORT0_DT0PRI
DSPD_FLAG0: U3.P15(IO_L16N_3) ; sheet D/FLAG0
DSPD_FLAG1: U3.N15(IO_L17P_3/VREF_3) ; sheet D/FLAG1
DSPD_FLAG4: U3.P16(IO_L01N_3/VRP_3) ; sheet D/FLAG4
DSPD_FS1: U3.L15(IO_L22N_3) ; sheet D/PPI_FS1
DSPD_MISO: U3.J16(IO_L40N_3/VREF_3) ; sheet D/SPI_MISO
DSPD_MOSI: U3.P14(IO_L16P_3) ; sheet D/SPI_MOSI
DSPD_RESET: U3.M15(IO_L20P_3) ; sheet D/RESET
DSPD_RFS0: U3.K12(IO_L23N_3) ; sheet D/SPORT0_RFS0
DSPD_RFS1: U3.L13(IO_L21N_3) ; sheet D/SPORT1_RFS1
DSPD_SCK: U3.R16(IO_L01P_3/VRN_3) ; sheet D/SPI_SCK
DSPD_SCLK: U3.L14(IO_L22P_3) ; sheet D/SPORT_SCLK
DSPD_SS: U3.N16(IO_L17N_3) ; sheet D/SPI_SS
DSPD_TFS0: U3.N14(IO_L19P_3) ; sheet D/SPORT0_TFS0
DSPD_TFS1: U3.H16(IO_L40P_2/VREF_2) ; sheet D/SPORT1_TFS1
DSPD_UARTRX: U3.L12(IO_L23P_3/VREF_3) ; sheet D/UART_RX
DSPD_UARTTX: U3.K16(IO_L40P_3) ; sheet D/UART_TX
DSP~{EMU}: P2.2 U4.4(IN)
DSP~{EMU}BUF: R35.1 U4.16(OUT) ; sheet A/EMU, sheet B/EMU, sheet C/EMU, sheet D/EMU
DSP~{TRST}: P2.10 U4.6(IN)
DSP~{TRST}BUF: U4.14(OUT) ; sheet A/TRST, sheet B/TRST, sheet C/TRST, sheet D/TRST
DSPTCK: P2.8 U4.11(IN) U4.13(IN) U4.15(IN) U4.17(IN)
DSPTDI: P2.12 U4.8(IN)
DSPTDO: P2.14 ; sheet D/TDO
DSPTMS: P2.6 U4.2(IN)
DSPTMSBUF: U4.18(OUT) ; sheet A/TMS, sheet B/TMS, sheet C/TMS, sheet D/TMS
PPI0: U3.B4(IO_L01N_0/VRP_0)
PPI1: U3.A3(IO/VREF_0)
PPI2: U3.B5(IO_L25P_0)
PPI3: U3.A4(IO_L01P_0/VRN_0)
PPI4: U3.B6(IO_L28P_0)
PPI5: U3.A5(IO)
PPI6: U3.B7(IO_L30P_0)
PPI7: U3.A7(IO)
PPICLK: U3.C5(IO_L25N_0) ; sheet A/PPI_CLK, sheet B/PPI_CLK, sheet C/PPI_CLK, sheet D/PPI_CLK
NetP2_3: P2.3 R18.1
NetU1.A_T4: sheet A/TDO, sheet B/TDI
NetU1.A_U3: U4.12(OUT) ; sheet A/TDI
NetU1.A_U4: U4.9(OUT) ; sheet A/TCK
NetU1.B_T4: sheet B/TDO, sheet C/TDI
NetU1.B_U4: U4.7(OUT) ; sheet B/TCK
NetU1.C_T4: sheet C/TDO, sheet D/TDI
NetU1.C_U4: U4.5(OUT) ; sheet C/TCK
NetU1.D_U4: U4.3(OUT) ; sheet D/TCK

Not connected (* = marked no-connect by the designer): U3 C9(IO_L32N_1/GCLK5) D6(IO_L27P_0) E3(IO_L19N_7/VREF_7) E4(IO_L21P_7) E10(IO_L30P_1) E13(IO_L19N_2) E14(IO_L19P_2) F14(IO_L22N_2) G3(IO_L24N_7) G4(IO_L24P_7) G5(IO_L23N_7) G14(IO_L24N_2) H1(IO_L40N_7/VREF_7) H3(IO_L39N_7) H4(IO_L39P_7) J14(IO_L39N_3)

### Buses and harness runs
bus PPI[0..7]
bus PPI[0..7] = sheet A/PPI[0..7]
bus PPI[0..7] = sheet B/PPI[0..7]
bus PPI[0..7] = sheet C/PPI[0..7]
bus PPI[0..7] = sheet D/PPI[0..7]

### Notes on the sheet
- Title:
- Engineer:
- Date:
- Revision:
- Sheet
- of
- File:

### Library data of the parts
P2 = Header 7X2: Header, 7-Pin, Dual row; LatestRevisionDate: 17-Jul-2002; LatestRevisionNote: Re-released for DXP Platform.; Publisher: Altium Limited
R18 R35 = RESISTOR: Standard Passive Resistor; Tolerance: 1%
U3 = XC3S200-FT256: Xilinx Spartan-3 FPGA

## Sheet DSP.SCHDOC
size B
Used 4 times, as channels FPGA/A, FPGA/B, FPGA/C, FPGA/D. Parts and nets are listed once, with the designators drawn on the sheet.
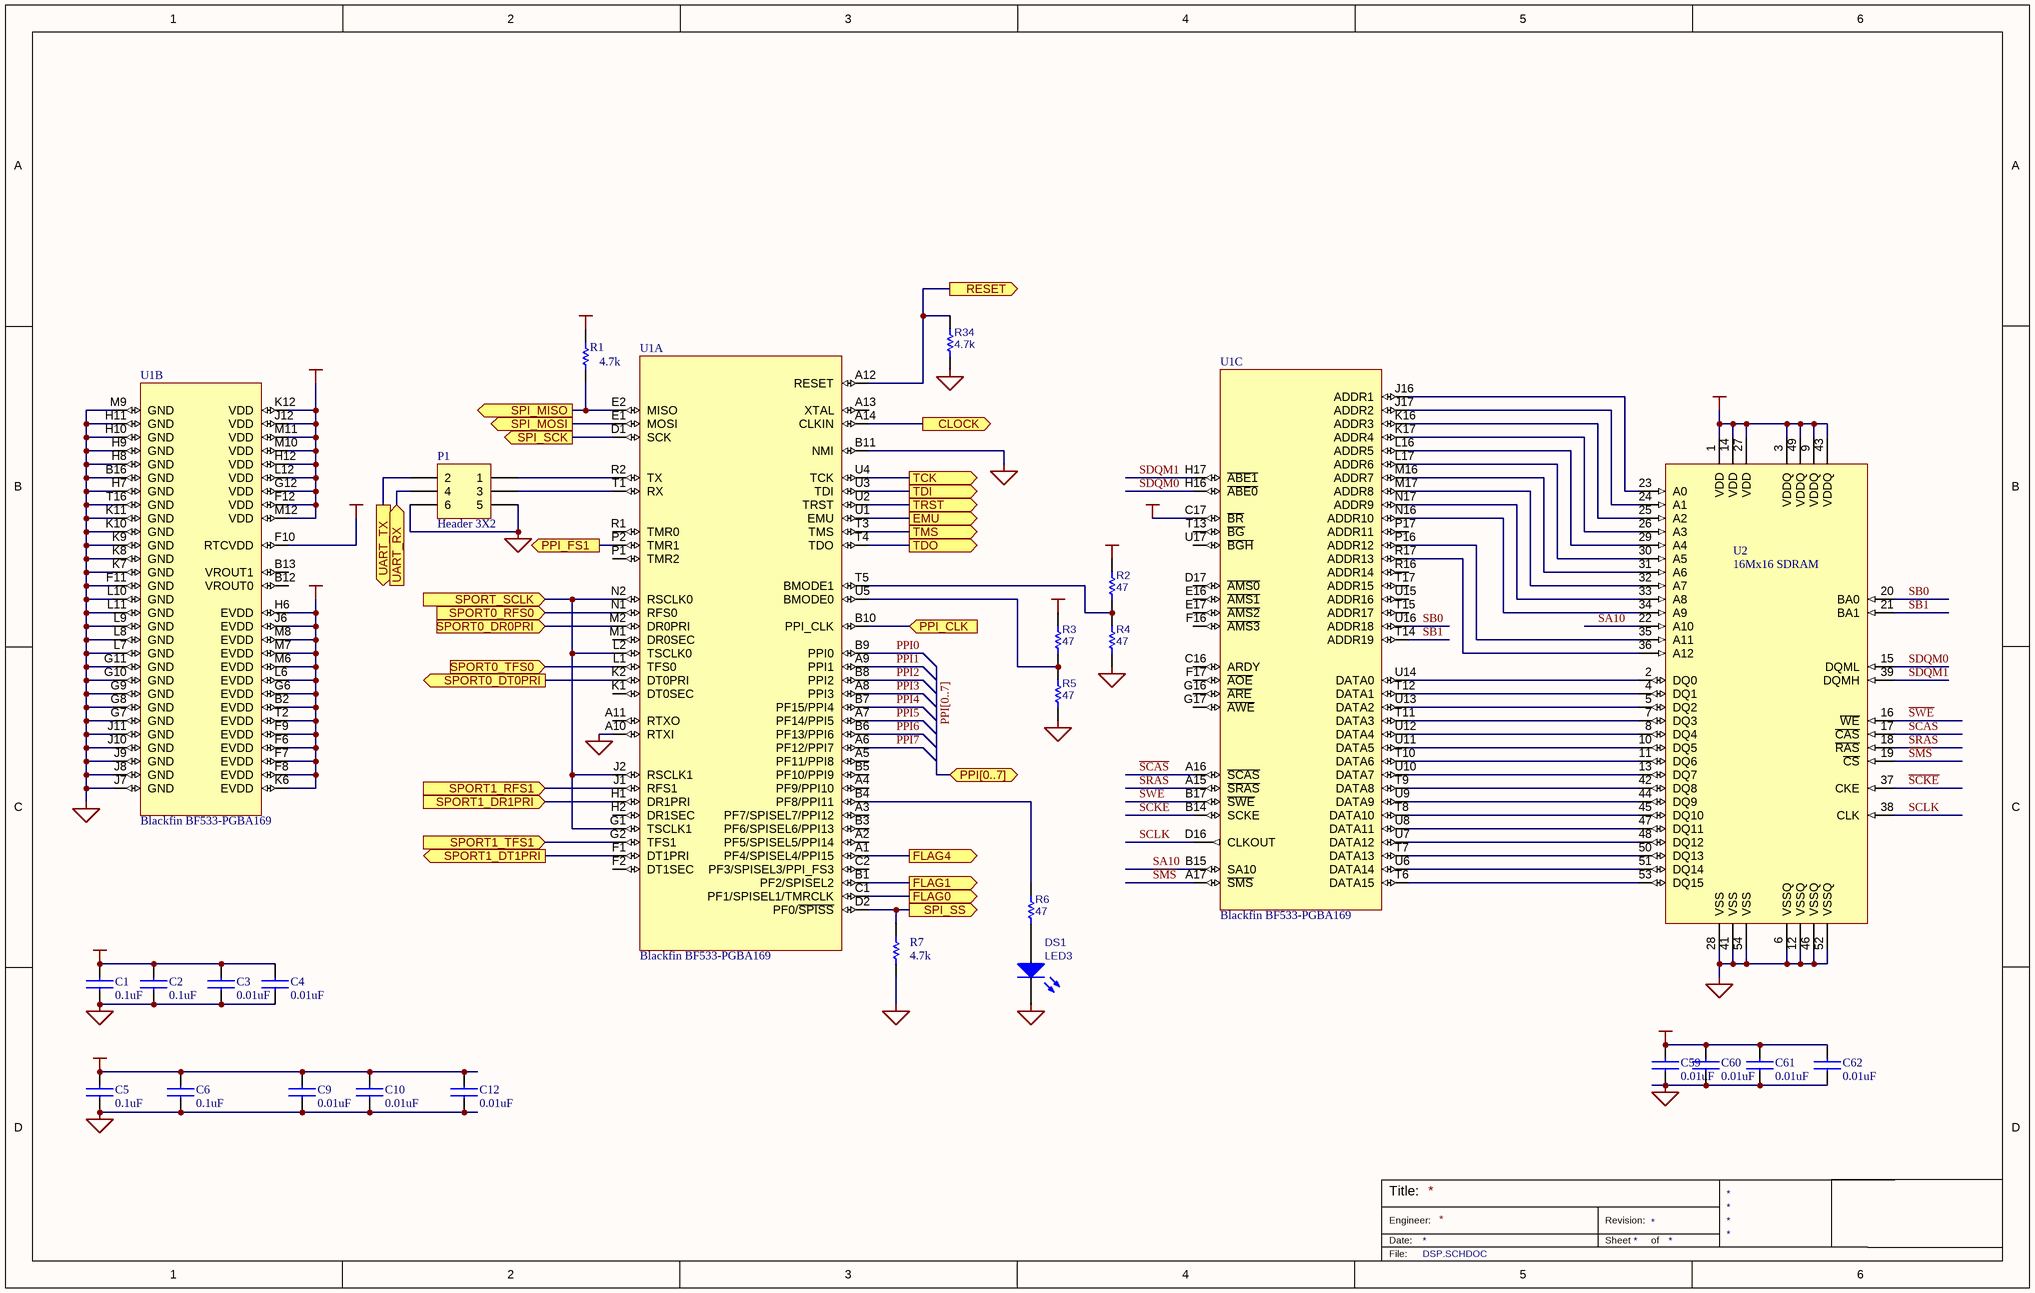
[diagram p5: DSP.SCHDOC]

### Parts
C1  value 0.1uF  [0603]  (hidden comment: CAPACITOR)
C2  value 0.1uF  [0603]  (hidden comment: CAPACITOR)
C3  value 0.01uF  [0402]  (hidden comment: CAPACITOR)
C4  value 0.01uF  [0402]  (hidden comment: CAPACITOR)
C5  value 0.1uF  [0603]  (hidden comment: CAPACITOR)
C6  value 0.1uF  [0603]  (hidden comment: CAPACITOR)
C9  value 0.01uF  [0402]  (hidden comment: CAPACITOR)
C10  value 0.01uF  [0402]  (hidden comment: CAPACITOR)
C12  value 0.01uF  [0402]  (hidden comment: CAPACITOR)
C59  value 0.01uF  [0402]  (hidden comment: CAPACITOR)
C60  value 0.01uF  [0402]  (hidden comment: CAPACITOR)
C61  value 0.01uF  [0402]  (hidden comment: CAPACITOR)
C62  value 0.01uF  [0402]  (hidden comment: CAPACITOR)
DS1  LED3  [LED0805]
P1  Header 3X2  [HDR2X3]
R1  value 4.7k  [0603]  (hidden comment: RESISTOR)
R2  value 47  [0603]  (hidden comment: RESISTOR)
R3  value 47  [0603]  (hidden comment: RESISTOR)
R4  value 47  [0603]  (hidden comment: RESISTOR)
R5  value 47  [0603]  (hidden comment: RESISTOR)
R6  value 47  [0603]  (hidden comment: RESISTOR)
R7  value 4.7k  [0603]  (hidden comment: RESISTOR)
R34  value 4.7k  [0603]  (hidden comment: RESISTOR)
U1  Blackfin BF533-PGBA169  [AD PBGA-169]  (parts A,B,C of 3)
U2  16Mx16 SDRAM  [SO-G54/X.5]

### Ports
CLOCK (out), EMU (out), FLAG0 (out), FLAG1 (out), FLAG4 (out), PPI[0..7] (bidir), PPI_CLK (in), PPI_FS1 (out), RESET (out), SPI_MISO (out), SPI_MOSI (out), SPI_SCK (out), SPI_SS (out), SPORT0_DR0PRI (in), SPORT0_DT0PRI (out), SPORT0_RFS0 (in), SPORT0_TFS0 (in), SPORT1_DR1PRI (in), SPORT1_DT1PRI (out), SPORT1_RFS1 (in), SPORT1_TFS1 (in), SPORT_SCLK (in), TCK (out), TDI (out), TDO (out), TMS (out), TRST (out), UART_RX (in), UART_TX (out)

### Nets
+1.2VCC: C1.2 C2.2 C3.2 C4.2 U1.F12(VDD) U1.G12(VDD) U1.H12(VDD) U1.J12(VDD) U1.K12(VDD) U1.L12(VDD) U1.M10(VDD) U1.M11(VDD) U1.M12(VDD)
GND: C1.1 C2.1 C3.1 C4.1 C5.1 C6.1 C9.1 C10.1 C12.1 C59.1 C60.1 C61.1 C62.1 DS1.2(K) P1.5 P1.6 R4.2 R5.2 R7.1 R34.2 U1.A10(RTXI) U1.B11(NMI) U1.B16(GND) U1.F11(GND) U1.G7(GND) U1.G8(GND) U1.G9(GND) U1.G10(GND) U1.G11(GND) U1.H7(GND) U1.H8(GND) U1.H9(GND) U1.H10(GND) U1.H11(GND) U1.J7(GND) U1.J8(GND) U1.J9(GND) U1.J10(GND) U1.J11(GND) U1.K7(GND) U1.K8(GND) U1.K9(GND) U1.K10(GND) U1.K11(GND) U1.L7(GND) U1.L8(GND) U1.L9(GND) U1.L10(GND) U1.L11(GND) U1.M9(GND) U1.T16(GND) U2.6(VSSQ) U2.12(VSSQ) U2.28(VSS) U2.41(VSS) U2.46(VSSQ) U2.52(VSSQ) U2.54(VSS)
VCC: C5.2 C6.2 C9.2 C10.2 C12.2 C59.2 C60.2 C61.2 C62.2 R1.2 R2.1 R3.1 U1.B2(EVDD) U1.C17(~{BR}) U1.F6(EVDD) U1.F7(EVDD) U1.F8(EVDD) U1.F9(EVDD) U1.F10(RTCVDD) U1.G6(EVDD) U1.H6(EVDD) U1.J6(EVDD) U1.K6(EVDD) U1.L6(EVDD) U1.M6(EVDD) U1.M7(EVDD) U1.M8(EVDD) U1.T2(EVDD) U2.1(VDD) U2.3(VDDQ) U2.9(VDDQ) U2.14(VDD) U2.27(VDD) U2.43(VDDQ) U2.49(VDDQ)
CLOCK: U1.A14(CLKIN) ; port CLOCK
EMU: U1.U1(EMU) ; port EMU
FLAG0: U1.C1(PF1/SPISEL1/TMRCLK) ; port FLAG0
FLAG1: U1.B1(PF2/SPISEL2) ; port FLAG1
FLAG4: U1.A1(PF4/SPISEL4/PPI15) ; port FLAG4
PPI0: U1.B9(PPI0)
PPI1: U1.A9(PPI1)
PPI2: U1.B8(PPI2)
PPI3: U1.A8(PPI3)
PPI4: U1.B7(PF15/PPI4)
PPI5: U1.A7(PF14/PPI5)
PPI6: U1.B6(PF13/PPI6)
PPI7: U1.A6(PF12/PPI7)
PPI_CLK: U1.B10(PPI_CLK) ; port PPI_CLK
PPI_FS1: U1.P2(TMR1) ; port PPI_FS1
RESET: R34.1 U1.A12(RESET) ; port RESET
~{SCAS}: U1.A16(~{SCAS}) U2.17(~{CAS})
~{SCKE}: U1.B14(SCKE) U2.37(CKE)
~{SMS}: U1.A17(~{SMS}) U2.19(~{CS})
~{SRAS}: U1.A15(~{SRAS}) U2.18(~{RAS})
~{SWE}: U1.B17(~{SWE}) U2.16(~{WE})
SA10: U1.B15(SA10) U2.22(A10)
SB0: U1.U16(ADDR18) U2.20(BA0)
SB1: U1.T14(ADDR19) U2.21(BA1)
SCLK: U1.D16(CLKOUT) U2.38(CLK)
SDQM0: U1.H16(~{ABE0}) U2.15(DQML)
SDQM1: U1.H17(~{ABE1}) U2.39(DQMH)
SPI_MISO: R1.1 U1.E2(MISO) ; port SPI_MISO
SPI_MOSI: U1.E1(MOSI) ; port SPI_MOSI
SPI_SCK: U1.D1(SCK) ; port SPI_SCK
SPI_SS: R7.2 U1.D2(PF0/~{SPISS}) ; port SPI_SS
SPORT0_DR0PRI: U1.M2(DR0PRI) ; port SPORT0_DR0PRI
SPORT0_DT0PRI: U1.K2(DT0PRI) ; port SPORT0_DT0PRI
SPORT0_RFS0: U1.N1(RFS0) ; port SPORT0_RFS0
SPORT0_TFS0: U1.L1(TFS0) ; port SPORT0_TFS0
SPORT1_DR1PRI: U1.H1(DR1PRI) ; port SPORT1_DR1PRI
SPORT1_DT1PRI: U1.F1(DT1PRI) ; port SPORT1_DT1PRI
SPORT1_RFS1: U1.J1(RFS1) ; port SPORT1_RFS1
SPORT1_TFS1: U1.G2(TFS1) ; port SPORT1_TFS1
SPORT_SCLK: U1.G1(TSCLK1) U1.J2(RSCLK1) U1.L2(TSCLK0) U1.N2(RSCLK0) ; port SPORT_SCLK
TCK: U1.U4(TCK) ; port TCK
TDI: U1.U3(TDI) ; port TDI
TDO: U1.T4(TDO) ; port TDO
TMS: U1.T3(TMS) ; port TMS
TRST: U1.U2(TRST) ; port TRST
UART_RX: P1.4 ; port UART_RX
UART_TX: P1.2 ; port UART_TX
NetDS1_1: DS1.1(A) R6.2
NetP1_1: P1.1 U1.R2(TX)
NetP1_3: P1.3 U1.T1(RX)
NetR2_2: R2.2 R4.1 U1.T5(BMODE1)
NetR3_2: R3.2 R5.1 U1.U5(BMODE0)
NetR6_1: R6.1 U1.B4(PF8/PPI11)
NetU1_J16: U1.J16(ADDR1) U2.23(A0)
NetU1_J17: U1.J17(ADDR2) U2.24(A1)
NetU1_K16: U1.K16(ADDR3) U2.25(A2)
NetU1_K17: U1.K17(ADDR4) U2.26(A3)
NetU1_L16: U1.L16(ADDR5) U2.29(A4)
NetU1_L17: U1.L17(ADDR6) U2.30(A5)
NetU1_M16: U1.M16(ADDR7) U2.31(A6)
NetU1_M17: U1.M17(ADDR8) U2.32(A7)
NetU1_N16: U1.N16(ADDR10) U2.34(A9)
NetU1_N17: U1.N17(ADDR9) U2.33(A8)
NetU1_P16: U1.P16(ADDR12) U2.35(A11)
NetU1_R17: U1.R17(ADDR13) U2.36(A12)
NetU1_T6: U1.T6(DATA15) U2.53(DQ15)
NetU1_T7: U1.T7(DATA13) U2.50(DQ13)
NetU1_T8: U1.T8(DATA10) U2.45(DQ10)
NetU1_T9: U1.T9(DATA8) U2.42(DQ8)
NetU1_T10: U1.T10(DATA6) U2.11(DQ6)
NetU1_T11: U1.T11(DATA3) U2.7(DQ3)
NetU1_T12: U1.T12(DATA1) U2.4(DQ1)
NetU1_U6: U1.U6(DATA14) U2.51(DQ14)
NetU1_U7: U1.U7(DATA12) U2.48(DQ12)
NetU1_U8: U1.U8(DATA11) U2.47(DQ11)
NetU1_U9: U1.U9(DATA9) U2.44(DQ9)
NetU1_U10: U1.U10(DATA7) U2.13(DQ7)
NetU1_U11: U1.U11(DATA5) U2.10(DQ5)
NetU1_U12: U1.U12(DATA4) U2.8(DQ4)
NetU1_U13: U1.U13(DATA2) U2.5(DQ2)
NetU1_U14: U1.U14(DATA0) U2.2(DQ0)

Not connected (* = marked no-connect by the designer): U1 A2(PF5/SPISEL5/PPI14) A3(PF7/SPISEL7/PPI12) A4(PF9/PPI10) A5(PF11/PPI8) A11(RTXO) A13(XTAL) B3(PF6/SPISEL6/PPI13) B5(PF10/PPI9) B12(VROUT0) B13(VROUT1) C2(PF3/SPISEL3/PPI_FS3) C16(ARDY) D17(~{AMS0}) E16(~{AMS1}) E17(~{AMS2}) F2(DT1SEC) F16(~{AMS3}) F17(~{AOE}) G16(~{ARE}) G17(~{AWE}) H2(DR1SEC) K1(DT0SEC) M1(DR0SEC) P1(TMR2) P17(ADDR11) R1(TMR0) R16(ADDR14) T13(~{BG}) T15(ADDR17) T17(ADDR15) U15(ADDR16) U17(~{BGH})

### Channels
FPGA/A: designators end in .A; ports CLOCK=DSPA_CLK EMU=DSP~{EMU}BUF FLAG0=DSPA_FLAG0 FLAG1=DSPA_FLAG1 FLAG4=DSPA_FLAG4 PPI_CLK=PPICLK PPI_FS1=DSPA_FS1 RESET=DSPA_RESET SPI_MISO=DSPA_MISO SPI_MOSI=DSPA_MOSI SPI_SCK=DSPA_SCK SPI_SS=DSPA_SS SPORT0_DR0PRI=DSPA_DR0PRI SPORT0_DT0PRI=DSPA_DTOPRI SPORT0_RFS0=DSPA_RFS0 SPORT0_TFS0=DSPA_TFS0 SPORT1_DR1PRI=DSPA_DR1PRI SPORT1_DT1PRI=DSPA_DT1PRI SPORT1_RFS1=DSPA_RFS1 SPORT1_TFS1=DSPA_TFS1 SPORT_SCLK=DSPA_SCLK TCK=NetU1.A_U4 TDI=NetU1.A_U3 TDO=NetU1.A_T4 TMS=DSPTMSBUF TRST=DSP~{TRST}BUF UART_RX=DSPA_UARTRX UART_TX=DSPA_UARTTX
FPGA/B: designators end in .B; ports CLOCK=DSPB_CLK EMU=DSP~{EMU}BUF FLAG0=DSPB_FLAG0 FLAG1=DSPB_FLAG1 FLAG4=DSPB_FLAG4 PPI_CLK=PPICLK PPI_FS1=DSPB_FS1 RESET=DSPB_RESET SPI_MISO=DSPB_MISO SPI_MOSI=DSPB_MOSI SPI_SCK=DSPB_SCK SPI_SS=DSPB_SS SPORT0_DR0PRI=DSPB_DR0PRI SPORT0_DT0PRI=DSPB_DTOPRI SPORT0_RFS0=DSPB_RFS0 SPORT0_TFS0=DSPB_TFS0 SPORT1_DR1PRI=DSPB_DR1PRI SPORT1_DT1PRI=DSPB_DT1PRI SPORT1_RFS1=DSPB_RFS1 SPORT1_TFS1=DSPB_TFS1 SPORT_SCLK=DSPB_SCLK TCK=NetU1.B_U4 TDI=NetU1.A_T4 TDO=NetU1.B_T4 TMS=DSPTMSBUF TRST=DSP~{TRST}BUF UART_RX=DSPB_UARTRX UART_TX=DSPB_UARTTX
FPGA/C: designators end in .C; ports CLOCK=DSPC_CLK EMU=DSP~{EMU}BUF FLAG0=DSPC_FLAG0 FLAG1=DSPC_FLAG1 FLAG4=DSPC_FLAG4 PPI_CLK=PPICLK PPI_FS1=DSPC_FS1 RESET=DSPC_RESET SPI_MISO=DSPC_MISO SPI_MOSI=DSPC_MOSI SPI_SCK=DSPC_SCK SPI_SS=DSPC_SS SPORT0_DR0PRI=DSPC_DR0PRI SPORT0_DT0PRI=DSPC_DTOPRI SPORT0_RFS0=DSPC_RFS0 SPORT0_TFS0=DSPC_TFS0 SPORT1_DR1PRI=DSPC_DR1PRI SPORT1_DT1PRI=DSPC_DT1PRI SPORT1_RFS1=DSPC_RFS1 SPORT1_TFS1=DSPC_TFS1 SPORT_SCLK=DSPC_SCLK TCK=NetU1.C_U4 TDI=NetU1.B_T4 TDO=NetU1.C_T4 TMS=DSPTMSBUF TRST=DSP~{TRST}BUF UART_RX=DSPC_UARTRX UART_TX=DSPC_UARTTX
FPGA/D: designators end in .D; ports CLOCK=DSPD_CLK EMU=DSP~{EMU}BUF FLAG0=DSPD_FLAG0 FLAG1=DSPD_FLAG1 FLAG4=DSPD_FLAG4 PPI_CLK=PPICLK PPI_FS1=DSPD_FS1 RESET=DSPD_RESET SPI_MISO=DSPD_MISO SPI_MOSI=DSPD_MOSI SPI_SCK=DSPD_SCK SPI_SS=DSPD_SS SPORT0_DR0PRI=DSPD_DR0PRI SPORT0_DT0PRI=DSPD_DTOPRI SPORT0_RFS0=DSPD_RFS0 SPORT0_TFS0=DSPD_TFS0 SPORT1_DR1PRI=DSPD_DR1PRI SPORT1_DT1PRI=DSPD_DT1PRI SPORT1_RFS1=DSPD_RFS1 SPORT1_TFS1=DSPD_TFS1 SPORT_SCLK=DSPD_SCLK TCK=NetU1.D_U4 TDI=NetU1.C_T4 TDO=DSPTDO TMS=DSPTMSBUF TRST=DSP~{TRST}BUF UART_RX=DSPD_UARTRX UART_TX=DSPD_UARTTX

### Buses and harness runs
bus PPI[0..7] = port PPI[0..7]

### Notes on the sheet
- Title:
- Engineer:
- Date:
- Revision:
- Sheet
- of
- File:

### Library data of the parts
C1-C6 C9 C10 C12 C59-C62 = CAPACITOR: Standard Capacitor
DS1 = LED3: Typical BLUE SiC LED; Published: 8-Jun-2000; LatestRevisionDate: 17-Dec-2003; LatestRevisionNote: PCB Footprint replaced.; Publisher: Altium Limited
P1 = Header 3X2: Header, 3-Pin, Dual row; LatestRevisionDate: 17-Jul-2002; LatestRevisionNote: Re-released for DXP Platform.; Publisher: Altium Limited
R1-R7 R34 = RESISTOR: Standard Passive Resistor; Tolerance: 1%
U1 = ADSP-BF53x-PBGA169: Analog Devices Blackfin
U2 = MT48LC16M16A2TG: Micron 16Mbitx16 SDRAM

## Nets that join several sheets
+1.2VCC: PowerClocks (17 pins), FPGA/A (13 pins), FPGA/B (13 pins), FPGA/C (13 pins), FPGA/D (13 pins)
+2.5VCC: PowerClocks (22 pins), FPGAIO (U3.J5 U3.J6 U3.K6)
+5VCC: FPGAIO (IO1.P7 IO1.P8 IO1.P9), fiber (11 pins)
GND: PowerClocks (92 pins), FPGAIO (22 pins), fiber (21 pins), FPGA (10 pins), FPGA/A (58 pins), FPGA/B (58 pins), FPGA/C (58 pins), FPGA/D (58 pins)
VCC: PowerClocks (30 pins), FPGAIO (19 pins), FPGA (18 pins), FPGA/A (35 pins), FPGA/B (35 pins), FPGA/C (35 pins), FPGA/D (35 pins)
DSPA_CLK: FPGA (U3.C1), FPGA/A (U1.A.A14)
DSPA_DR0PRI: FPGA (U3.F2), FPGA/A (U1.A.M2)
DSPA_DR1PRI: FPGA (U3.D2), FPGA/A (U1.A.H1)
DSPA_DT1PRI: FPGA (U3.E1), FPGA/A (U1.A.F1)
DSPA_DTOPRI: FPGA (U3.D1), FPGA/A (U1.A.K2)
DSPA_FLAG0: FPGA (U3.C7), FPGA/A (U1.A.C1)
DSPA_FLAG1: FPGA (U3.B8), FPGA/A (U1.A.B1)
DSPA_FLAG4: FPGA (U3.A8), FPGA/A (U1.A.A1)
DSPA_FS1: FPGA (U3.D5), FPGA/A (U1.A.P2)
DSPA_MISO: FPGA (U3.C3), FPGA/A (R1.A.1 U1.A.E2)
DSPA_MOSI: FPGA (U3.C2), FPGA/A (U1.A.E1)
DSPA_RESET: FPGA (U3.B1), FPGA/A (R34.A.1 U1.A.A12)
DSPA_RFS0: FPGA (U3.G2), FPGA/A (U1.A.N1)
DSPA_RFS1: FPGA (U3.D3), FPGA/A (U1.A.J1)
DSPA_SCK: FPGA (U3.C8), FPGA/A (U1.A.D1)
DSPA_SCLK: FPGA (U3.F3), FPGA/A (U1.A.G1 U1.A.J2 U1.A.L2 U1.A.N2)
DSPA_SS: FPGA (U3.C6), FPGA/A (R7.A.2 U1.A.D2)
DSPA_TFS0: FPGA (U3.E2), FPGA/A (U1.A.L1)
DSPA_TFS1: FPGA (U3.G1), FPGA/A (U1.A.G2)
DSPA_UARTRX: FPGA (U3.F5), FPGA/A (P1.A.4)
DSPA_UARTTX: FPGA (U3.F4), FPGA/A (P1.A.2)
DSPB_CLK: FPGA (U3.A9), FPGA/B (U1.B.A14)
DSPB_DR0PRI: FPGA (U3.D8), FPGA/B (U1.B.M2)
DSPB_DR1PRI: FPGA (U3.D10), FPGA/B (U1.B.H1)
DSPB_DT1PRI: FPGA (U3.E11), FPGA/B (U1.B.F1)
DSPB_DTOPRI: FPGA (U3.C10), FPGA/B (U1.B.K2)
DSPB_FLAG0: FPGA (U3.A13), FPGA/B (U1.B.C1)
DSPB_FLAG1: FPGA (U3.B13), FPGA/B (U1.B.B1)
DSPB_FLAG4: FPGA (U3.B14), FPGA/B (U1.B.A1)
DSPB_FS1: FPGA (U3.C11), FPGA/B (U1.B.P2)
DSPB_MISO: FPGA (U3.A14), FPGA/B (R1.B.1 U1.B.E2)
DSPB_MOSI: FPGA (U3.A10), FPGA/B (U1.B.E1)
DSPB_RESET: FPGA (U3.B10), FPGA/B (R34.B.1 U1.B.A12)
DSPB_RFS0: FPGA (U3.D9), FPGA/B (U1.B.N1)
DSPB_RFS1: FPGA (U3.D11), FPGA/B (U1.B.J1)
DSPB_SCK: FPGA (U3.B12), FPGA/B (U1.B.D1)
DSPB_SCLK: FPGA (U3.D7), FPGA/B (U1.B.G1 U1.B.J2 U1.B.L2 U1.B.N2)
DSPB_SS: FPGA (U3.B11), FPGA/B (R7.B.2 U1.B.D2)
DSPB_TFS0: FPGA (U3.C12), FPGA/B (U1.B.L1)
DSPB_TFS1: FPGA (U3.A12), FPGA/B (U1.B.G2)
DSPB_UARTRX: FPGA (U3.E7), FPGA/B (P1.B.4)
DSPB_UARTTX: FPGA (U3.E6), FPGA/B (P1.B.2)
DSPC_CLK: FPGA (U3.D15), FPGA/C (U1.C.A14)
DSPC_DR0PRI: FPGA (U3.D14), FPGA/C (U1.C.M2)
DSPC_DR1PRI: FPGA (U3.H14), FPGA/C (U1.C.H1)
DSPC_DT1PRI: FPGA (U3.H13), FPGA/C (U1.C.F1)
DSPC_DTOPRI: FPGA (U3.C15), FPGA/C (U1.C.K2)
DSPC_FLAG0: FPGA (U3.G15), FPGA/C (U1.C.C1)
DSPC_FLAG1: FPGA (U3.E16), FPGA/C (U1.C.B1)
DSPC_FLAG4: FPGA (U3.F15), FPGA/C (U1.C.A1)
DSPC_FS1: FPGA (U3.K15), FPGA/C (U1.C.P2)
DSPC_MISO: FPGA (U3.B16), FPGA/C (R1.C.1 U1.C.E2)
DSPC_MOSI: FPGA (U3.C16), FPGA/C (U1.C.E1)
DSPC_RESET: FPGA (U3.D16), FPGA/C (R34.C.1 U1.C.A12)
DSPC_RFS0: FPGA (U3.F13), FPGA/C (U1.C.N1)
DSPC_RFS1: FPGA (U3.D12), FPGA/C (U1.C.J1)
DSPC_SCK: FPGA (U3.G16), FPGA/C (U1.C.D1)
DSPC_SCLK: FPGA (U3.G12), FPGA/C (U1.C.G1 U1.C.J2 U1.C.L2 U1.C.N2)
DSPC_SS: FPGA (U3.E15), FPGA/C (R7.C.2 U1.C.D2)
DSPC_TFS0: FPGA (U3.G13), FPGA/C (U1.C.L1)
DSPC_TFS1: FPGA (U3.F12), FPGA/C (U1.C.G2)
DSPC_UARTRX: FPGA (U3.K14), FPGA/C (P1.C.4)
DSPC_UARTTX: FPGA (U3.K13), FPGA/C (P1.C.2)
DSPD_CLK: FPGA (U3.M16), FPGA/D (U1.D.A14)
DSPD_DR0PRI: FPGA (U3.H15), FPGA/D (U1.D.M2)
DSPD_DR1PRI: FPGA (U3.M14), FPGA/D (U1.D.H1)
DSPD_DT1PRI: FPGA (U3.M13), FPGA/D (U1.D.F1)
DSPD_DTOPRI: FPGA (U3.J13), FPGA/D (U1.D.K2)
DSPD_FLAG0: FPGA (U3.P15), FPGA/D (U1.D.C1)
DSPD_FLAG1: FPGA (U3.N15), FPGA/D (U1.D.B1)
DSPD_FLAG4: FPGA (U3.P16), FPGA/D (U1.D.A1)
DSPD_FS1: FPGA (U3.L15), FPGA/D (U1.D.P2)
DSPD_MISO: FPGA (U3.J16), FPGA/D (R1.D.1 U1.D.E2)
DSPD_MOSI: FPGA (U3.P14), FPGA/D (U1.D.E1)
DSPD_RESET: FPGA (U3.M15), FPGA/D (R34.D.1 U1.D.A12)
DSPD_RFS0: FPGA (U3.K12), FPGA/D (U1.D.N1)
DSPD_RFS1: FPGA (U3.L13), FPGA/D (U1.D.J1)
DSPD_SCK: FPGA (U3.R16), FPGA/D (U1.D.D1)
DSPD_SCLK: FPGA (U3.L14), FPGA/D (U1.D.G1 U1.D.J2 U1.D.L2 U1.D.N2)
DSPD_SS: FPGA (U3.N16), FPGA/D (R7.D.2 U1.D.D2)
DSPD_TFS0: FPGA (U3.N14), FPGA/D (U1.D.L1)
DSPD_TFS1: FPGA (U3.H16), FPGA/D (U1.D.G2)
DSPD_UARTRX: FPGA (U3.L12), FPGA/D (P1.D.4)
DSPD_UARTTX: FPGA (U3.K16), FPGA/D (P1.D.2)
DSP~{EMU}BUF: FPGA (R35.1 U4.16), FPGA/A (U1.A.U1), FPGA/B (U1.B.U1), FPGA/C (U1.C.U1), FPGA/D (U1.D.U1)
DSP~{TRST}BUF: FPGA (U4.14), FPGA/A (U1.A.U2), FPGA/B (U1.B.U2), FPGA/C (U1.C.U2), FPGA/D (U1.D.U2)
DSPTDO: FPGA (P2.14), FPGA/D (U1.D.T4)
DSPTMSBUF: FPGA (U4.18), FPGA/A (U1.A.T3), FPGA/B (U1.B.T3), FPGA/C (U1.C.T3), FPGA/D (U1.D.T3)
NetIO1_P13: PowerClocks (U9.8), FPGAIO (IO1.P13 IO1.P14 IO1.P15)
NetO1_3: PowerClocks (O1.3 U9.1), FPGAIO (U3.R9)
NetR24_1: FPGAIO (U3.P10), fiber (R24.1)
NetR28_1: FPGAIO (U3.N10), fiber (R28.1)
NetU1.A_T4: FPGA/A (U1.A.T4), FPGA/B (U1.B.U3)
NetU1.A_U3: FPGA (U4.12), FPGA/A (U1.A.U3)
NetU1.A_U4: FPGA (U4.9), FPGA/A (U1.A.U4)
NetU1.B_T4: FPGA/B (U1.B.T4), FPGA/C (U1.C.U3)
NetU1.B_U4: FPGA (U4.7), FPGA/B (U1.B.U4)
NetU1.C_T4: FPGA/C (U1.C.T4), FPGA/D (U1.D.U3)
NetU1.C_U4: FPGA (U4.5), FPGA/C (U1.C.U4)
NetU1.D_U4: FPGA (U4.3), FPGA/D (U1.D.U4)
NetU3_M11: PowerClocks (U9.40), FPGAIO (U3.M11)
NetU3_N9: PowerClocks (U9.39), FPGAIO (U3.N9)
NetU3_P12: FPGAIO (U3.P12), fiber (U10.2)
NetU3_P13: FPGAIO (U3.P13), fiber (U10.7)
PPI0: FPGA (U3.B4), FPGA/A (U1.A.B9), FPGA/B (U1.B.B9), FPGA/C (U1.C.B9), FPGA/D (U1.D.B9)
PPI1: FPGA (U3.A3), FPGA/A (U1.A.A9), FPGA/B (U1.B.A9), FPGA/C (U1.C.A9), FPGA/D (U1.D.A9)
PPI2: FPGA (U3.B5), FPGA/A (U1.A.B8), FPGA/B (U1.B.B8), FPGA/C (U1.C.B8), FPGA/D (U1.D.B8)
PPI3: FPGA (U3.A4), FPGA/A (U1.A.A8), FPGA/B (U1.B.A8), FPGA/C (U1.C.A8), FPGA/D (U1.D.A8)
PPI4: FPGA (U3.B6), FPGA/A (U1.A.B7), FPGA/B (U1.B.B7), FPGA/C (U1.C.B7), FPGA/D (U1.D.B7)
PPI5: FPGA (U3.A5), FPGA/A (U1.A.A7), FPGA/B (U1.B.A7), FPGA/C (U1.C.A7), FPGA/D (U1.D.A7)
PPI6: FPGA (U3.B7), FPGA/A (U1.A.B6), FPGA/B (U1.B.B6), FPGA/C (U1.C.B6), FPGA/D (U1.D.B6)
PPI7: FPGA (U3.A7), FPGA/A (U1.A.A6), FPGA/B (U1.B.A6), FPGA/C (U1.C.A6), FPGA/D (U1.D.A6)
PPICLK: FPGA (U3.C5), FPGA/A (U1.A.B10), FPGA/B (U1.B.B10), FPGA/C (U1.C.B10), FPGA/D (U1.D.B10)